# EAGLE design TRISThis (EAGLE 5.11)

## Sheet 1 of 2
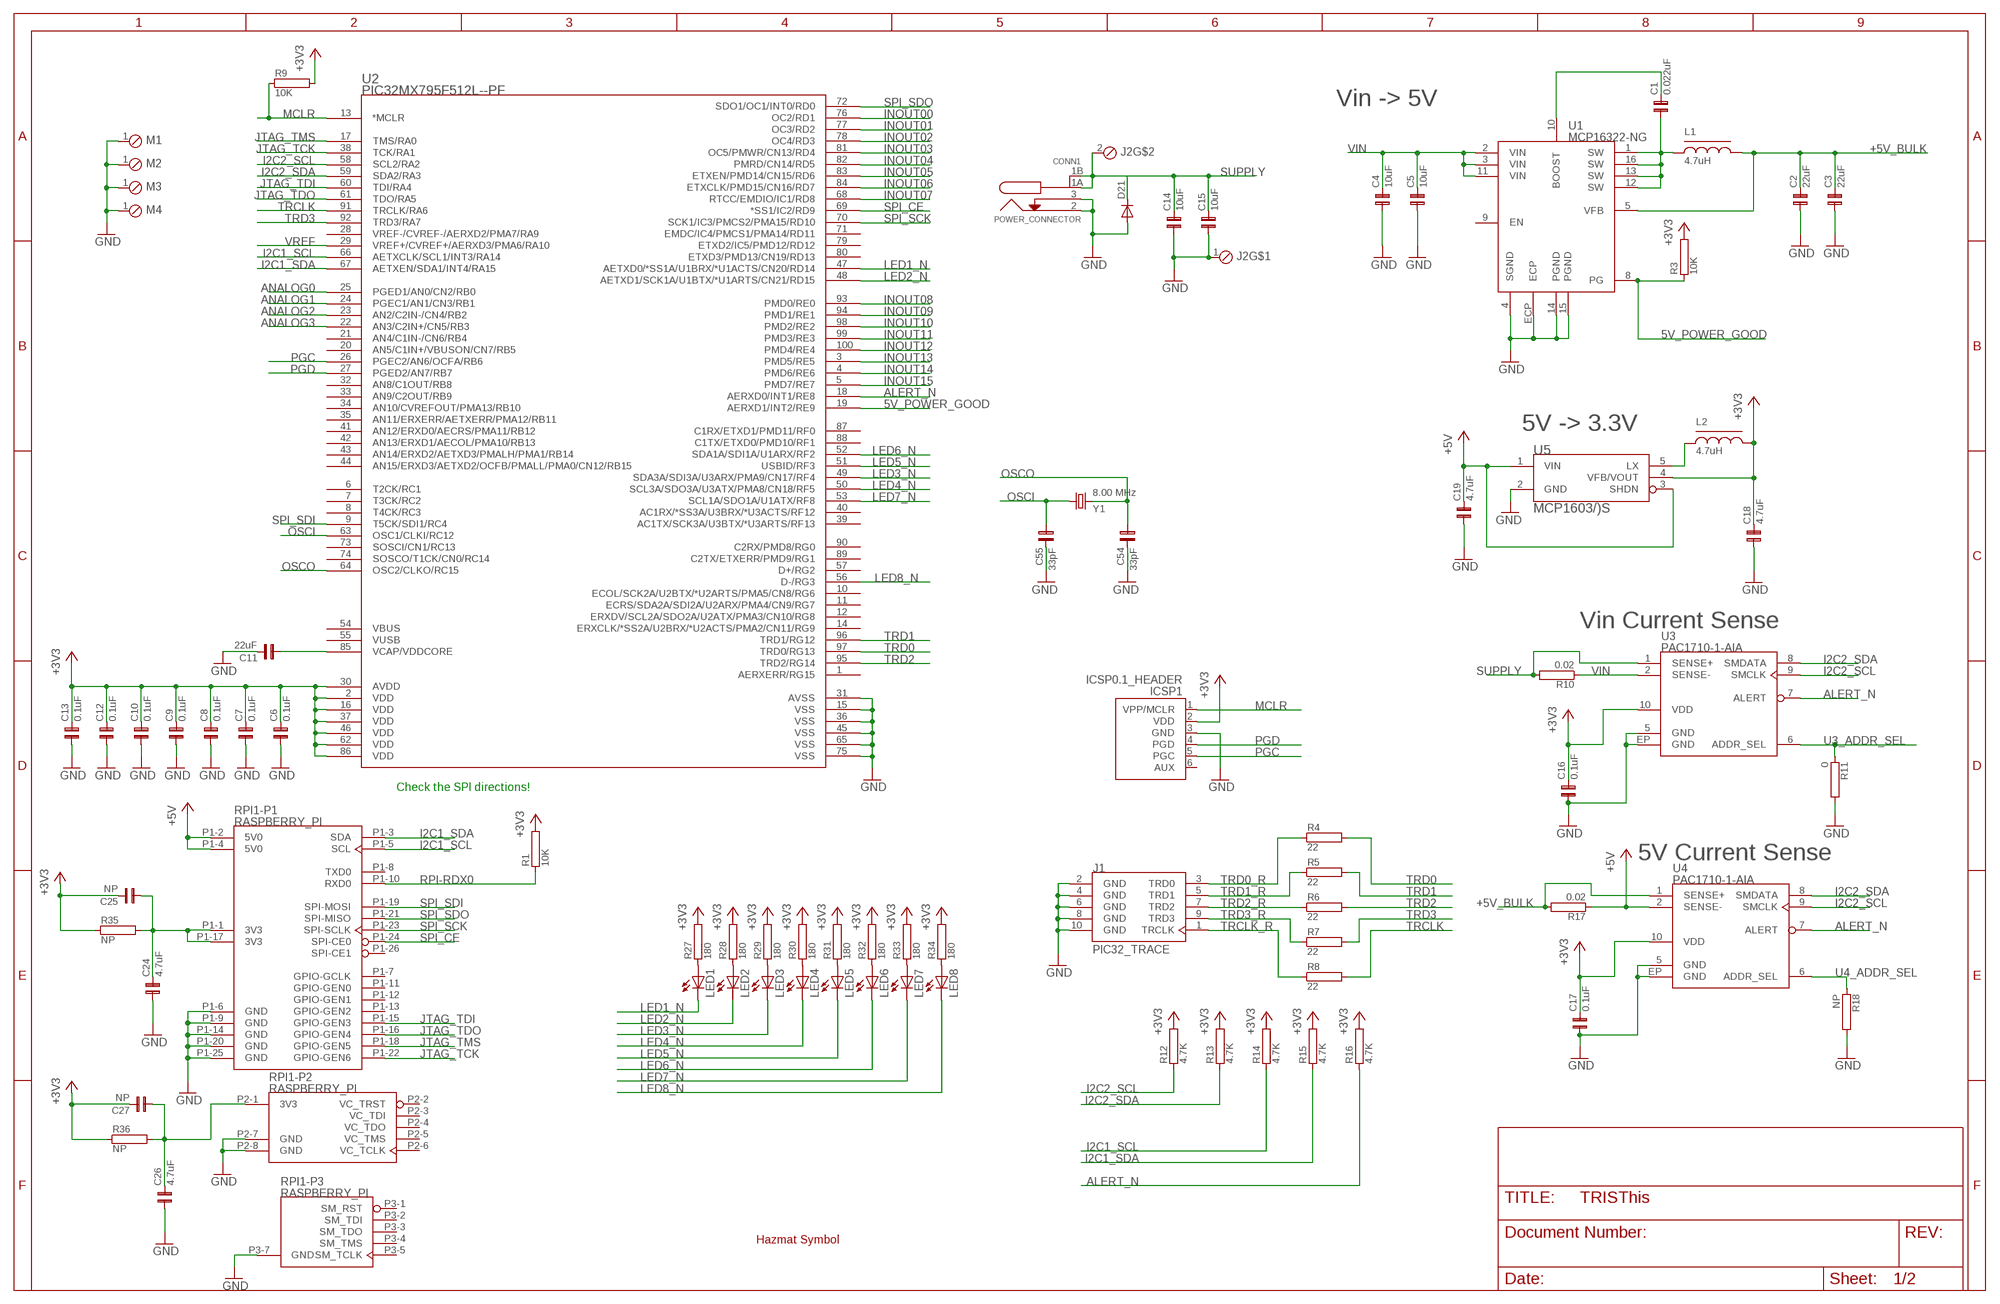
[diagram p0: schematic, sheet 1]

### Parts
C1  0.022uF  CU_SMT0603  [C0603]
C2  22uF  CU_SMT0805  [C0805]
C3  22uF  CU_SMT0805  [C0805]
C4  10uF  CU_SMT0805  [C0805]
C5  10uF  CU_SMT0805  [C0805]
C6  0.1uF  CU_SMT0603  [C0603]
C7  0.1uF  CU_SMT0603  [C0603]
C8  0.1uF  CU_SMT0603  [C0603]
C9  0.1uF  CU_SMT0603  [C0603]
C10  0.1uF  CU_SMT0603  [C0603]
C11  22uF  CU_SMT0805  [C0805]
C12  0.1uF  CU_SMT0603  [C0603]
C13  0.1uF  CU_SMT0603  [C0603]
C14  10uF  CU_SMT0805  [C0805]
C15  10uF  CU_SMT0805  [C0805]
C16  0.1uF  CU_SMT0603  [C0603]
C17  0.1uF  CU_SMT0603  [C0603]
C18  4.7uF  CU_SMT0805  [C0805]
C19  4.7uF  CU_SMT0805  [C0805]
C24  4.7uF  CU_SMT0805  [C0805]
C25  NP  CU_SMT0805  [C0805]
C26  4.7uF  CU_SMT0805  [C0805]
C27  NP  CU_SMT0805  [C0805]
C54  33pF  CU_SMT0603  [C0603]
C55  33pF  CU_SMT0603  [C0603]
CONN1  POWER_CONNECTOR  [PJ-002BH-SMT]
D21  SOD-123  [SOD-123]
ICSP1  ICSP0.1_HEADER  [ICSP]
J1  PIC32_TRACE  [2X05]
J2  2P_HEADER  [2POL254]
L1  4.7uH  L_SMTWE-PD  [WE-PD]
L2  4.7uH  L_SMTWE-PD  [WE-PD]
LED1  LEDCHIPLED_0603  [CHIPLED_0603]
LED2  LEDCHIPLED_0603  [CHIPLED_0603]
LED3  LEDCHIPLED_0603  [CHIPLED_0603]
LED4  LEDCHIPLED_0603  [CHIPLED_0603]
LED5  LEDCHIPLED_0603  [CHIPLED_0603]
LED6  LEDCHIPLED_0603  [CHIPLED_0603]
LED7  LEDCHIPLED_0603  [CHIPLED_0603]
LED8  LEDCHIPLED_0603  [CHIPLED_0603]
M1  MOUNTING  [0125_MOUNT]
M2  MOUNTING  [0125_MOUNT]
M3  MOUNTING  [0125_MOUNT]
M4  MOUNTING  [0125_MOUNT]
R1  10K  R_SMT0603  [R0603]
R3  10K  R_SMT0603  [R0603]
R4  22  R_SMT0603  [R0603]
R5  22  R_SMT0603  [R0603]
R6  22  R_SMT0603  [R0603]
R7  22  R_SMT0603  [R0603]
R8  22  R_SMT0603  [R0603]
R9  10K  R_SMT0603  [R0603]
R10  0.02  R_SMT1210  [R1210]
R11  0  R_SMT0603  [R0603]
R12  4.7K  R_SMT0603  [R0603]
R13  4.7K  R_SMT0603  [R0603]
R14  4.7K  R_SMT0603  [R0603]
R15  4.7K  R_SMT0603  [R0603]
R16  4.7K  R_SMT0603  [R0603]
R17  0.02  R_SMT1210  [R1210]
R18  NP  R_SMT0603  [R0603]
R27  180  R_SMT0603  [R0603]
R28  180  R_SMT0603  [R0603]
R29  180  R_SMT0603  [R0603]
R30  180  R_SMT0603  [R0603]
R31  180  R_SMT0603  [R0603]
R32  180  R_SMT0603  [R0603]
R33  180  R_SMT0603  [R0603]
R34  180  R_SMT0603  [R0603]
R35  NP  R_SMT0603  [R0603]
R36  NP  R_SMT0603  [R0603]
RPI1  RASPBERRY_PI  [RPI]
U1  MCP16322-NG  [NG]
U2  PIC32MX795F512L--PF  [TQFP100_14X14]
U3  PAC1710-1-AIA  [DFN10]
U4  PAC1710-1-AIA  [DFN10]
U5  MCP1603/)S  MCP1603/OS  [TSOT5_MC]
U$1  HAZMATSYMBOL  [HAZMATSYMBOL]
Y1  8.00 MHz  CS10  [CS10]

### Nets
5V_POWER_GOOD: R3.1 U1.8(PG) U2.19(AERXD1/INT2/RE9)
+3V3: C6.2 C7.2 C8.2 C9.2 C10.2 C12.2 C13.2 C16.2 C17.2 C18.2 C25.2 C27.2 ICSP1.2(VDD) L2.2 R1.2 R3.2 R9.2 R12.2 R13.2 R14.2 R15.2 R16.2 R27.2 R28.2 R29.2 R30.2 R31.2 R32.2 R33.2 R34.2 R35.1 R36.1 U2.2(VDD) U2.16(VDD) U2.30(AVDD) U2.37(VDD) U2.46(VDD) U2.62(VDD) U2.86(VDD) U3.10(VDD) U4.10(VDD) U5.4(VFB/VOUT) ; also sheet 2
+5V: C19.2 R17.1 RPI1.P1-2(-P1:5V0) RPI1.P1-4(-P1:5V0) U4.2(SENSE-) U5.1(VIN) U5.3(SHDN)
+5V_BULK: C2.2 C3.2 L1.2 R17.2 U1.5(VFB) U4.1(SENSE+)
ALERT_N: R16.1 U2.18(AERXD0/INT1/RE8) U3.7(ALERT) U4.7(ALERT)
ANALOG0: U2.25(PGED1/AN0/CN2/RB0) ; also sheet 2
ANALOG1: U2.24(PGEC1/AN1/CN3/RB1) ; also sheet 2
ANALOG2: U2.23(AN2/C2IN-/CN4/RB2) ; also sheet 2
ANALOG3: U2.22(AN3/C2IN+/CN5/RB3) ; also sheet 2
BOOST: C1.2 U1.10(BOOST)
GND: C2.1 C3.1 C4.1 C5.1 C6.1 C7.1 C8.1 C9.1 C10.1 C11.2 C12.1 C13.1 C14.1 C15.1 C16.1 C17.1 C18.1 C19.1 C24.1 C26.1 C54.2 C55.2 CONN1.2(SHIELD) CONN1.3(SHIELD_SWITCHED) D21.A ICSP1.3(GND) J1.2(GND) J1.4(GND) J1.6(GND) J1.8(GND) J1.10(GND) J2.1 M1.1 M2.1 M3.1 M4.1 R11.2 R18.2 RPI1.P1-6(-P1:GND) RPI1.P1-9(-P1:GND) RPI1.P1-14(-P1:GND) RPI1.P1-20(-P1:GND) RPI1.P1-25(-P1:GND) RPI1.P2-7(-P2:GND) RPI1.P2-8(-P2:GND) RPI1.P3-7(-P3:GND) U1.4(SGND) U1.14(PGND) U1.15(PGND) U1.ECP U2.15(VSS) U2.31(AVSS) U2.36(VSS) U2.45(VSS) U2.65(VSS) U2.75(VSS) U3.5(GND) U3.EP(GND) U4.5(GND) U4.EP(GND) U5.2(GND) ; also sheet 2
I2C1_SCL: R14.1 RPI1.P1-5(-P1:SCL) U2.66(AETXCLK/SCL1/INT3/RA14)
I2C1_SDA: R15.1 RPI1.P1-3(-P1:SDA) U2.67(AETXEN/SDA1/INT4/RA15)
I2C2_SCL: R12.1 U2.58(SCL2/RA2) U3.9(SMCLK) U4.9(SMCLK) ; also sheet 2
I2C2_SDA: R13.1 U2.59(SDA2/RA3) U3.8(SMDATA) U4.8(SMDATA) ; also sheet 2
INOUT00: U2.76(OC2/RD1) ; also sheet 2
INOUT01: U2.77(OC3/RD2) ; also sheet 2
INOUT02: U2.78(OC4/RD3) ; also sheet 2
INOUT03: U2.81(OC5/PMWR/CN13/RD4) ; also sheet 2
INOUT04: U2.82(PMRD/CN14/RD5) ; also sheet 2
INOUT05: U2.83(ETXEN/PMD14/CN15/RD6) ; also sheet 2
INOUT06: U2.84(ETXCLK/PMD15/CN16/RD7) ; also sheet 2
INOUT07: U2.68(RTCC/EMDIO/IC1/RD8) ; also sheet 2
INOUT08: U2.93(PMD0/RE0) ; also sheet 2
INOUT09: U2.94(PMD1/RE1) ; also sheet 2
INOUT10: U2.98(PMD2/RE2) ; also sheet 2
INOUT11: U2.99(PMD3/RE3) ; also sheet 2
INOUT12: U2.100(PMD4/RE4) ; also sheet 2
INOUT13: U2.3(PMD5/RE5) ; also sheet 2
INOUT14: U2.4(PMD6/RE6) ; also sheet 2
INOUT15: U2.5(PMD7/RE7) ; also sheet 2
JTAG_TCK: RPI1.P1-22(-P1:GPIO-GEN6) U2.38(TCK/RA1)
JTAG_TDI: RPI1.P1-15(-P1:GPIO-GEN3) U2.60(TDI/RA4)
JTAG_TDO: RPI1.P1-16(-P1:GPIO-GEN4) U2.61(TDO/RA5)
JTAG_TMS: RPI1.P1-18(-P1:GPIO-GEN5) U2.17(TMS/RA0)
LED1_N: LED1.C U2.47(AETXD0/*SS1A/U1BRX/*U1ACTS/CN20/RD14)
LED2_N: LED2.C U2.48(AETXD1/SCK1A/U1BTX/*U1ARTS/CN21/RD15)
LED3_N: LED3.C U2.49(SDA3A/SDI3A/U3ARX/PMA9/CN17/RF4)
LED4_N: LED4.C U2.50(SCL3A/SDO3A/U3ATX/PMA8/CN18/RF5)
LED5_N: LED5.C U2.51(USBID/RF3)
LED6_N: LED6.C U2.52(SDA1A/SDI1A/U1ARX/RF2)
LED7_N: LED7.C U2.53(SCL1A/SDO1A/U1ATX/RF8)
LED8_N: LED8.C U2.56(D-/RG3)
MCLR: ICSP1.1(VPP/MCLR) R9.1 U2.13(*MCLR)
N$2: L2.1 U5.5(LX)
N$5: LED1.A R27.1
N$11: LED2.A R28.1
N$13: LED3.A R29.1
N$14: LED4.A R30.1
N$15: LED5.A R31.1
N$16: LED6.A R32.1
N$17: LED7.A R33.1
N$18: LED8.A R34.1
OSCI: C55.1 U2.63(OSC1/CLKI/RC12) Y1.P$1
OSCO: C54.1 U2.64(OSC2/CLKO/RC15) Y1.P$2
PGC: ICSP1.5(PGC) U2.26(PGEC2/AN6/OCFA/RB6)
PGD: ICSP1.4(PGD) U2.27(PGED2/AN7/RB7)
RPI+3V1: C26.2 C27.1 R36.2 RPI1.P2-1(-P2:3V3)
RPI+3V3: C24.2 C25.1 R35.2 RPI1.P1-1(-P1:3V3) RPI1.P1-17(-P1:3V3)
RPI-RDX0: R1.1 RPI1.P1-10(-P1:RXD0)
SPI_CE: RPI1.P1-24(-P1:SPI-CE0) U2.69(*SS1/IC2/RD9)
SPI_SCK: RPI1.P1-23(-P1:SPI-SCLK) U2.70(SCK1/IC3/PMCS2/PMA15/RD10)
SPI_SDI: RPI1.P1-19(-P1:SPI-MOSI) U2.9(T5CK/SDI1/RC4)
SPI_SDO: RPI1.P1-21(-P1:SPI-MISO) U2.72(SDO1/OC1/INT0/RD0)
SUPPLY: C14.2 C15.2 CONN1.1A(CENTER-1) CONN1.1B(CENTER-2) D21.K J2.2 R10.2 U3.1(SENSE+)
SW: C1.1 L1.1 U1.1(SW) U1.12(SW) U1.13(SW) U1.16(SW)
TRCLK: R8.2 U2.91(TRCLK/RA6)
TRCLK_R: J1.1(TRCLK) R8.1
TRD0: R4.2 U2.97(TRD0/RG13)
TRD0_R: J1.3(TRD0) R4.1
TRD1: R5.2 U2.96(TRD1/RG12)
TRD1_R: J1.5(TRD1) R5.1
TRD2: R6.2 U2.95(TRD2/RG14)
TRD2_R: J1.7(TRD2) R6.1
TRD3: R7.2 U2.92(TRD3/RA7)
TRD3_R: J1.9(TRD3) R7.1
U3_ADDR_SEL: R11.1 U3.6(ADDR_SEL)
U4_ADDR_SEL: R18.1 U4.6(ADDR_SEL)
VDDCORE: C11.1 U2.85(VCAP/VDDCORE)
VIN: C4.2 C5.2 R10.1 U1.2(VIN) U1.3(VIN) U1.11(VIN) U3.2(SENSE-)
VREF: U2.29(VREF+/CVREF+/AERXD3/PMA6/RA10) ; also sheet 2
Unconnected: ICSP1.6(AUX) RPI1.P1-7(-P1:GPIO-GCLK) RPI1.P1-8(-P1:TXD0) RPI1.P1-11(-P1:GPIO-GEN0) RPI1.P1-12(-P1:GPIO-GEN1) RPI1.P1-13(-P1:GPIO-GEN2) RPI1.P1-26(-P1:SPI-CE1) RPI1.P2-2(-P2:VC_TRST) RPI1.P2-3(-P2:VC_TDI) RPI1.P2-4(-P2:VC_TDO) RPI1.P2-5(-P2:VC_TMS) RPI1.P2-6(-P2:VC_TCLK) RPI1.P3-1(-P3:SM_RST) RPI1.P3-2(-P3:SM_TDI) RPI1.P3-3(-P3:SM_TDO) RPI1.P3-4(-P3:SM_TMS) RPI1.P3-5(-P3:SM_TCLK) U1.9(EN) U2.1(AERXERR/RG15) U2.6(T2CK/RC1) U2.7(T3CK/RC2) U2.8(T4CK/RC3) U2.10(ECOL/SCK2A/U2BTX/*U2ARTS/PMA5/CN8/RG6) U2.11(ECRS/SDA2A/SDI2A/U2ARX/PMA4/CN9/RG7) U2.12(ERXDV/SCL2A/SDO2A/U2ATX/PMA3/CN10/RG8) U2.14(ERXCLK/*SS2A/U2BRX/*U2ACTS/PMA2/CN11/RG9) U2.20(AN5/C1IN+/VBUSON/CN7/RB5) U2.21(AN4/C1IN-/CN6/RB4) U2.28(VREF-/CVREF-/AERXD2/PMA7/RA9) U2.32(AN8/C1OUT/RB8) U2.33(AN9/C2OUT/RB9) U2.34(AN10/CVREFOUT/PMA13/RB10) U2.35(AN11/ERXERR/AETXERR/PMA12/RB11) U2.39(AC1TX/SCK3A/U3BTX/*U3ARTS/RF13) U2.40(AC1RX/*SS3A/U3BRX/*U3ACTS/RF12) U2.41(AN12/ERXD0/AECRS/PMA11/RB12) U2.42(AN13/ERXD1/AECOL/PMA10/RB13) U2.43(AN14/ERXD2/AETXD3/PMALH/PMA1/RB14) U2.44(AN15/ERXD3/AETXD2/OCFB/PMALL/PMA0/CN12/RB15) U2.54(VBUS) U2.55(VUSB) U2.57(D+/RG2) U2.71(EMDC/IC4/PMCS1/PMA14/RD11) U2.73(SOSCI/CN1/RC13) U2.74(SOSCO/T1CK/CN0/RC14) U2.79(ETXD2/IC5/PMD12/RD12) U2.80(ETXD3/PMD13/CN19/RD13) U2.87(C1RX/ETXD1/PMD11/RF0) U2.88(C1TX/ETXD0/PMD10/RF1) U2.89(C2TX/ETXERR/PMD9/RG1) U2.90(C2RX/PMD8/RG0)

### Notes on the sheet
- Vin -> 5V
- 5V -> 3.3V
- Vin Current Sense
- Check the SPI directions!
- 5V Current Sense

## Sheet 2 of 2
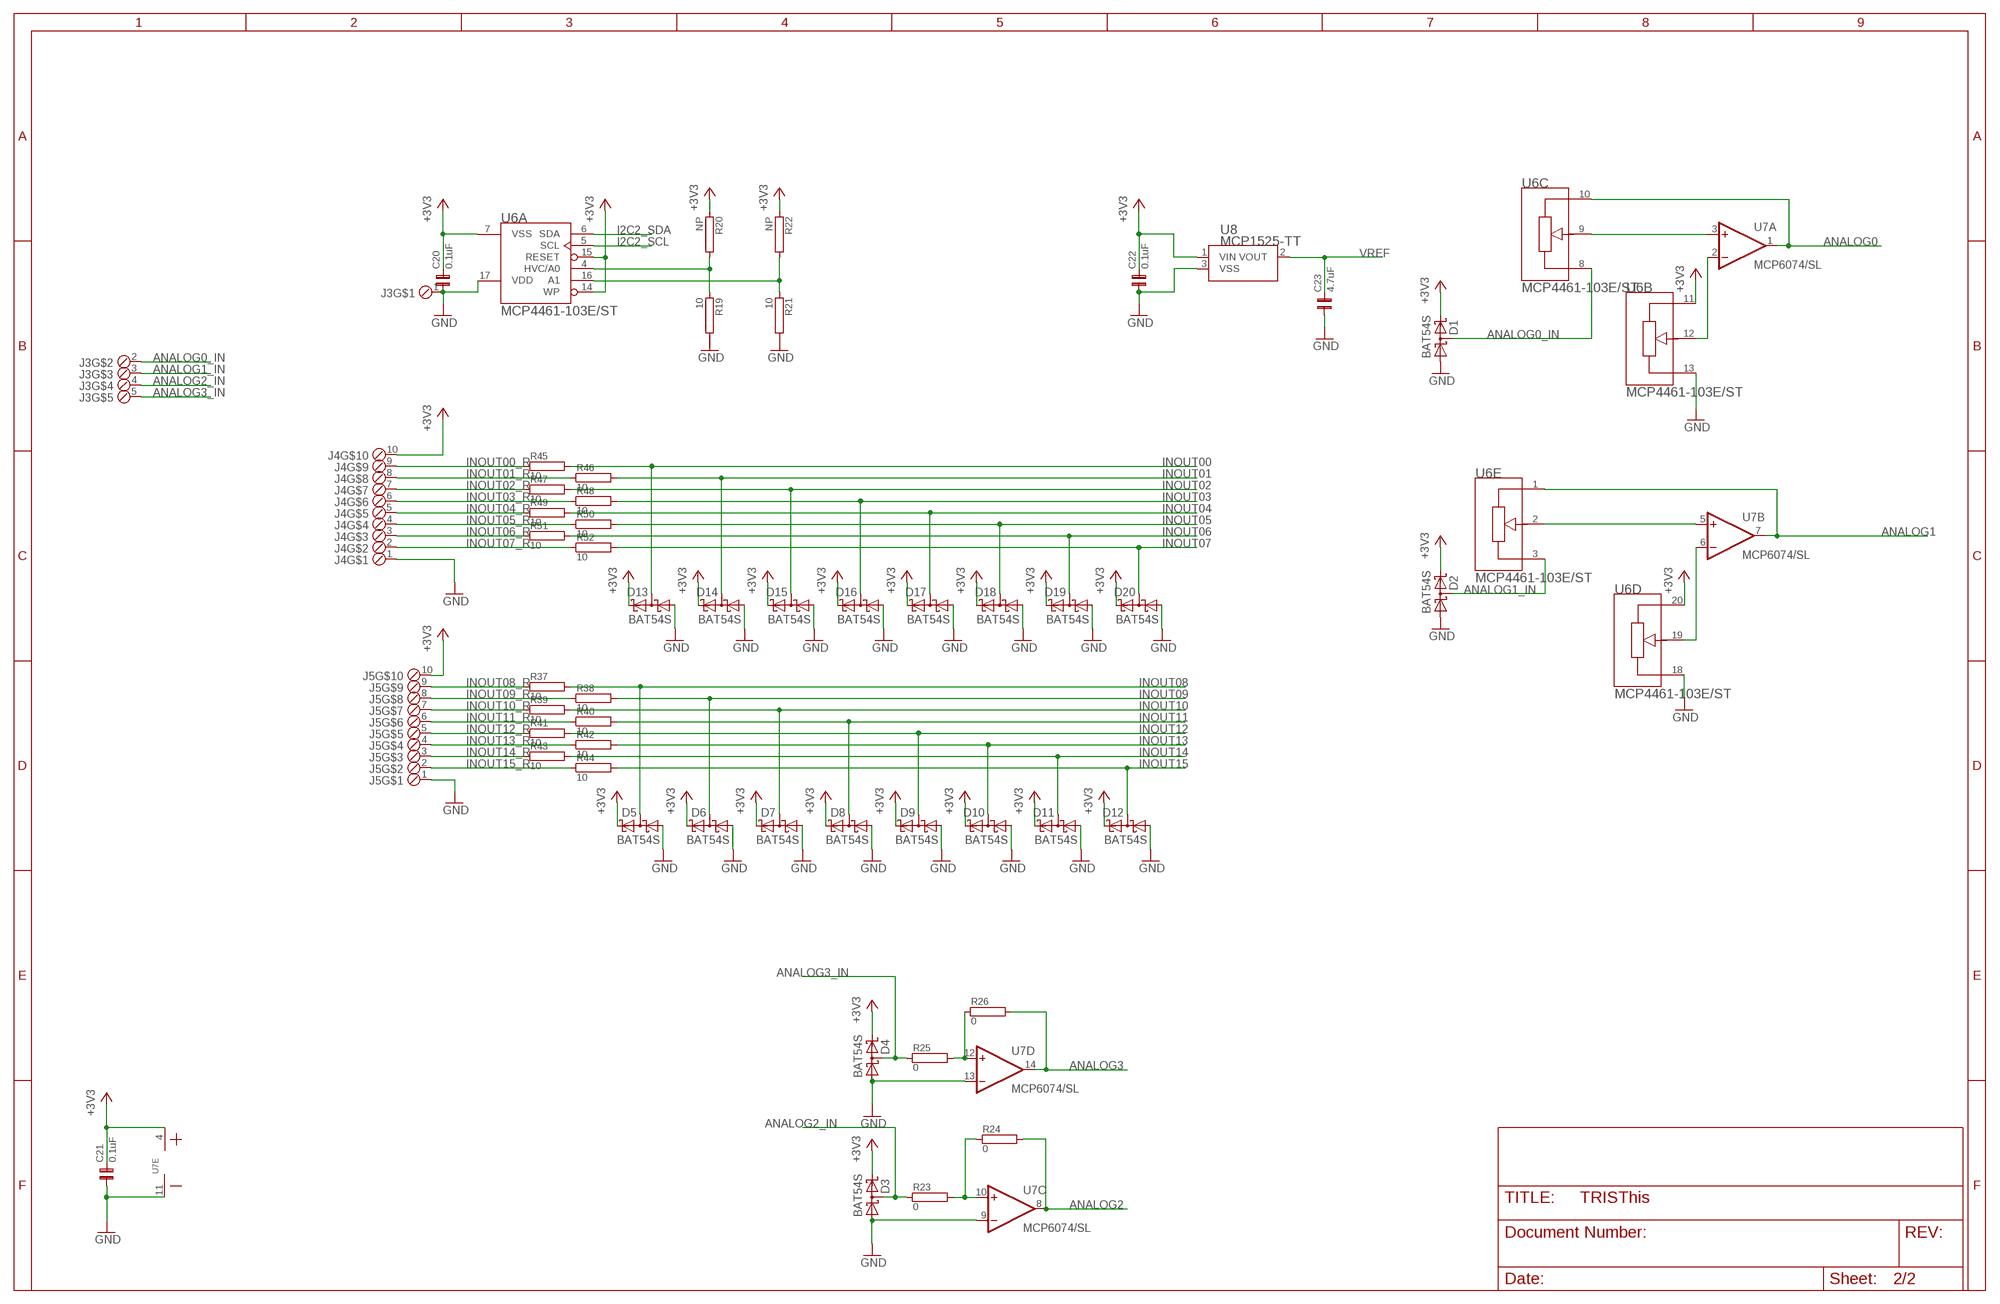
[diagram p1: schematic, sheet 2]

### Parts
C20  0.1uF  CU_SMT0603  [C0603]
C21  0.1uF  CU_SMT0603  [C0603]
C22  0.1uF  CU_SMT0603  [C0603]
C23  4.7uF  CU_SMT0603  [C0603]
D1  BAT54S  [SOT23]
D2  BAT54S  [SOT23]
D3  BAT54S  [SOT23]
D4  BAT54S  [SOT23]
D5  BAT54S  [SOT23]
D6  BAT54S  [SOT23]
D7  BAT54S  [SOT23]
D8  BAT54S  [SOT23]
D9  BAT54S  [SOT23]
D10  BAT54S  [SOT23]
D11  BAT54S  [SOT23]
D12  BAT54S  [SOT23]
D13  BAT54S  [SOT23]
D14  BAT54S  [SOT23]
D15  BAT54S  [SOT23]
D16  BAT54S  [SOT23]
D17  BAT54S  [SOT23]
D18  BAT54S  [SOT23]
D19  BAT54S  [SOT23]
D20  BAT54S  [SOT23]
J3  5P_HEADER  [5POL254]
J4  10P_HEADER  [10POL254]
J5  10P_HEADER  [10POL254]
R19  10  R_SMT0603  [R0603]
R20  NP  R_SMT0603  [R0603]
R21  10  R_SMT0603  [R0603]
R22  NP  R_SMT0603  [R0603]
R23  0  R_SMT0603  [R0603]
R24  0  R_SMT0603  [R0603]
R25  0  R_SMT0603  [R0603]
R26  0  R_SMT0603  [R0603]
R37  10  R_SMT0603  [R0603]
R38  10  R_SMT0603  [R0603]
R39  10  R_SMT0603  [R0603]
R40  10  R_SMT0603  [R0603]
R41  10  R_SMT0603  [R0603]
R42  10  R_SMT0603  [R0603]
R43  10  R_SMT0603  [R0603]
R44  10  R_SMT0603  [R0603]
R45  10  R_SMT0603  [R0603]
R46  10  R_SMT0603  [R0603]
R47  10  R_SMT0603  [R0603]
R48  10  R_SMT0603  [R0603]
R49  10  R_SMT0603  [R0603]
R50  10  R_SMT0603  [R0603]
R51  10  R_SMT0603  [R0603]
R52  10  R_SMT0603  [R0603]
U6  MCP4461-103E/ST  MCP4461/ST  [TSSOP20_MC]
U7  MCP6074/SL  [SOIC14-N_MC]
U8  MCP1525-TT  [SOT-23_MC]

### Nets
+3V3: C20.2 C21.2 C22.2 D1.2(C2) D2.2(C2) D3.2(C2) D4.2(C2) D5.2(C2) D6.2(C2) D7.2(C2) D8.2(C2) D9.2(C2) D10.2(C2) D11.2(C2) D12.2(C2) D13.2(C2) D14.2(C2) D15.2(C2) D16.2(C2) D17.2(C2) D18.2(C2) D19.2(C2) D20.2(C2) J4.10 J5.10 R20.1 R22.1 U6.7(A:VSS) U6.11(B:A) U6.14(A:WP) U6.15(A:RESET) U6.20(D:A) U7.4(E:V+) U8.1(VIN) ; also sheet 1
ADDR_SEL2: R19.1 R20.2 U6.4(A:HVC/A0)
ADDR_SEL3: R21.1 R22.2 U6.16(A:A1)
ANALOG0: U6.10(C:A) U7.1(A:OUT) ; also sheet 1
ANALOG0_IN: D1.3(C1A2) J3.2 U6.8(C:B)
ANALOG1: U6.1(E:A) U7.7(B:OUT) ; also sheet 1
ANALOG1_IN: D2.3(C1A2) J3.3 U6.3(E:B)
ANALOG2: R24.2 U7.8(C:OUT) ; also sheet 1
ANALOG2_IN: D3.3(C1A2) J3.4 R23.1
ANALOG3: R26.2 U7.14(D:OUT) ; also sheet 1
ANALOG3_IN: D4.3(C1A2) J3.5 R25.1
GND: C20.1 C21.1 C22.1 C23.1 D1.1(A1) D2.1(A1) D3.1(A1) D4.1(A1) D5.1(A1) D6.1(A1) D7.1(A1) D8.1(A1) D9.1(A1) D10.1(A1) D11.1(A1) D12.1(A1) D13.1(A1) D14.1(A1) D15.1(A1) D16.1(A1) D17.1(A1) D18.1(A1) D19.1(A1) D20.1(A1) J3.1 J4.1 J5.1 R19.2 R21.2 U6.13(B:B) U6.17(A:VDD) U6.18(D:B) U7.9(C:-IN) U7.11(E:V-) U7.13(D:-IN) U8.3(VSS) ; also sheet 1
I2C2_SCL: U6.5(A:SCL) ; also sheet 1
I2C2_SDA: U6.6(A:SDA) ; also sheet 1
INOUT00: D13.3(C1A2) R45.2 ; also sheet 1
INOUT00_R: J4.9 R45.1
INOUT01: D14.3(C1A2) R46.2 ; also sheet 1
INOUT01_R: J4.8 R46.1
INOUT02: D15.3(C1A2) R47.2 ; also sheet 1
INOUT02_R: J4.7 R47.1
INOUT03: D16.3(C1A2) R48.2 ; also sheet 1
INOUT03_R: J4.6 R48.1
INOUT04: D17.3(C1A2) R49.2 ; also sheet 1
INOUT04_R: J4.5 R49.1
INOUT05: D18.3(C1A2) R50.2 ; also sheet 1
INOUT05_R: J4.4 R50.1
INOUT06: D19.3(C1A2) R51.2 ; also sheet 1
INOUT06_R: J4.3 R51.1
INOUT07: D20.3(C1A2) R52.2 ; also sheet 1
INOUT07_R: J4.2 R52.1
INOUT08: D5.3(C1A2) R37.2 ; also sheet 1
INOUT08_R: J5.9 R37.1
INOUT09: D6.3(C1A2) R38.2 ; also sheet 1
INOUT09_R: J5.8 R38.1
INOUT10: D7.3(C1A2) R39.2 ; also sheet 1
INOUT10_R: J5.7 R39.1
INOUT11: D8.3(C1A2) R40.2 ; also sheet 1
INOUT11_R: J5.6 R40.1
INOUT12: D9.3(C1A2) R41.2 ; also sheet 1
INOUT12_R: J5.5 R41.1
INOUT13: D10.3(C1A2) R42.2 ; also sheet 1
INOUT13_R: J5.4 R42.1
INOUT14: D11.3(C1A2) R43.2 ; also sheet 1
INOUT14_R: J5.3 R43.1
INOUT15: D12.3(C1A2) R44.2 ; also sheet 1
INOUT15_R: J5.2 R44.1
N$4: U6.12(B:W) U7.2(A:-IN)
N$6: U6.9(C:W) U7.3(A:+IN)
N$7: U6.19(D:W) U7.6(B:-IN)
N$8: U6.2(E:W) U7.5(B:+IN)
N$9: R23.2 R24.1 U7.10(C:+IN)
N$12: R25.2 R26.1 U7.12(D:+IN)
VREF: C23.2 U8.2(VOUT) ; also sheet 1

## Library data of the parts
C1-C5 C11 C14 C15 C18 C19 C24-C27 = V3:CU_SMT: Unpolarized surface mount capacitors
C6-C10 C12 C13 C16 C17 C20-C23 = TRISThis:CU_SMT: Unpolarized surface mount capacitors
C54 C55 = PLM_Demo:CU_SMT: Unpolarized surface mount capacitors
CONN1 = untitled:POWER_CONNECTOR
D1-D20 = PLM_Demo:BAT54S
D21 = TridentSMD:SOD-123
ICSP1 = TRISThis:ICSP: Microchip ICSP connector
J1 = TRISThis:PIC32_TRACE
J2 = TRISThisConnectors:2P_HEADER: Buchanan 282834-2
J3 = TRISThisConnectors:5P_HEADER: Buchanan 282834-5
J4 J5 = TRISThisConnectors:10P_HEADER: Buchanan 282834-10
L1 L2 = MCP1632x:L_SMT
LED1-LED8 = PLM_Demo:LED: LED OSRAM: - CHIPLED LG R971, LG N971, LY N971, LG Q971, LY Q971, LO R971, LY R971 LH N974, LH R974 LS Q976, LO Q976, LY Q976 LO Q996 - Hyper CHIPLED LW Q18S LB Q993, LB Q99A, LB R99A - SideLED LS A670, LO A670, LY A670, LG A670, LP A670 LB A673, LV A673, LT A673, LW A673 LH A674 LY A675 LS A676, LA A676, LO A676, LY A676, LW A676 LS A679, LY A679, LG A679 - Hyper Micro SIDELED® LS Y876, LA Y876, LO Y876, LY Y876 LT Y87S - SmartLED LW L88C, LW L88S LB L89C, LB L89S, LG L890 LS L89K, LO L89K, LY L89K LS L896, LA L896, LO L896, LY L896 - TOPLED LS T670, LO T670, LY T670, LG T670, LP T670 LSG T670, LSP T670, LSY T670, LOP T670, LYG T670 LG T671, LOG T671, LSG T671 LB T673, LV T673, LT T673, LW T673 LH T674 LS T676, LA T676, LO T676, LY T676, LB T676, LH T676, LSB T676, LW T676 LB T67C, LV T67C, LT T67C, LS T67K, LO T67K, LY T67K, LW E67C LS E67B, LA E67B, LO E67B, LY E67B, LB E67C, LV E67C, LT E67C LW T67C LS T679, LY T679, LG T679 LS T770, LO T770, LY T770, LG T770, LP T770 LB T773, LV T773, LT T773, LW T773 LH T774 LS E675, LA E675, LY E675, LS T675 LS T776, LA T776, LO T776, LY T776, LB T776 LHGB T686 LT T68C, LB T68C - Hyper Mini TOPLED® LB M676 - Mini TOPLED Santana® LG M470 LS M47K, LO M47K, LY M47K Source: http://www.osram.convergy.de - LUMILED® LXK2-PW12-R00, LXK2-PW12-S00, LXK2-PW14-U00, LXK2-PW14-V00 LXK2-PM12-R00, LXK2-PM12-S00, LXK2-PM14-U00 LXK2-PE12-Q00, LXK2-PE12-R00, LXK2-PE12-S00, LXK2-PE14-T00, LXK2-PE14-U00 LXK2-PB12-K00, LXK2-PB12-L00, LXK2-PB12-M00, LXK2-PB14-N00, LXK2-PB14-P00, LXK2-PB14-Q00 LXK2-PR12-L00, LXK2-PR12-M00, LXK2-PR14-Q00, LXK2-PR14-R00 LXK2-PD12-Q00, LXK2-PD12-R00, LXK2-PD12-S00 LXK2-PH12-R00, LXK2-PH12-S00 LXK2-PL12-P00, LXK2-PL12-Q00, LXK2-PL12-R00 Source: www.luxeon.com
M1-M4 = TRISThisConnectors:MOUNTING
R1 R4-R52 = TRISThis:R_SMT
R3 = V3:R_SMT
RPI1 = RaspberryPi:RASPBERRY_PI
U1 = MCP1632x:MCP16322
U2 = TRISThis:PIC32MX795F512L-
U3 U4 = PAC1710:PAC1710-1
U5 = MCP1603:MCP1603
U6 = MCP4461:MCP4461
U7 = MCP6074:MCP6074
U8 = batterymon:MCP1525
U$1 = mjb-custom:HAZMATSYMBOL
Y1 = PLM_Demo:CS10

## Board
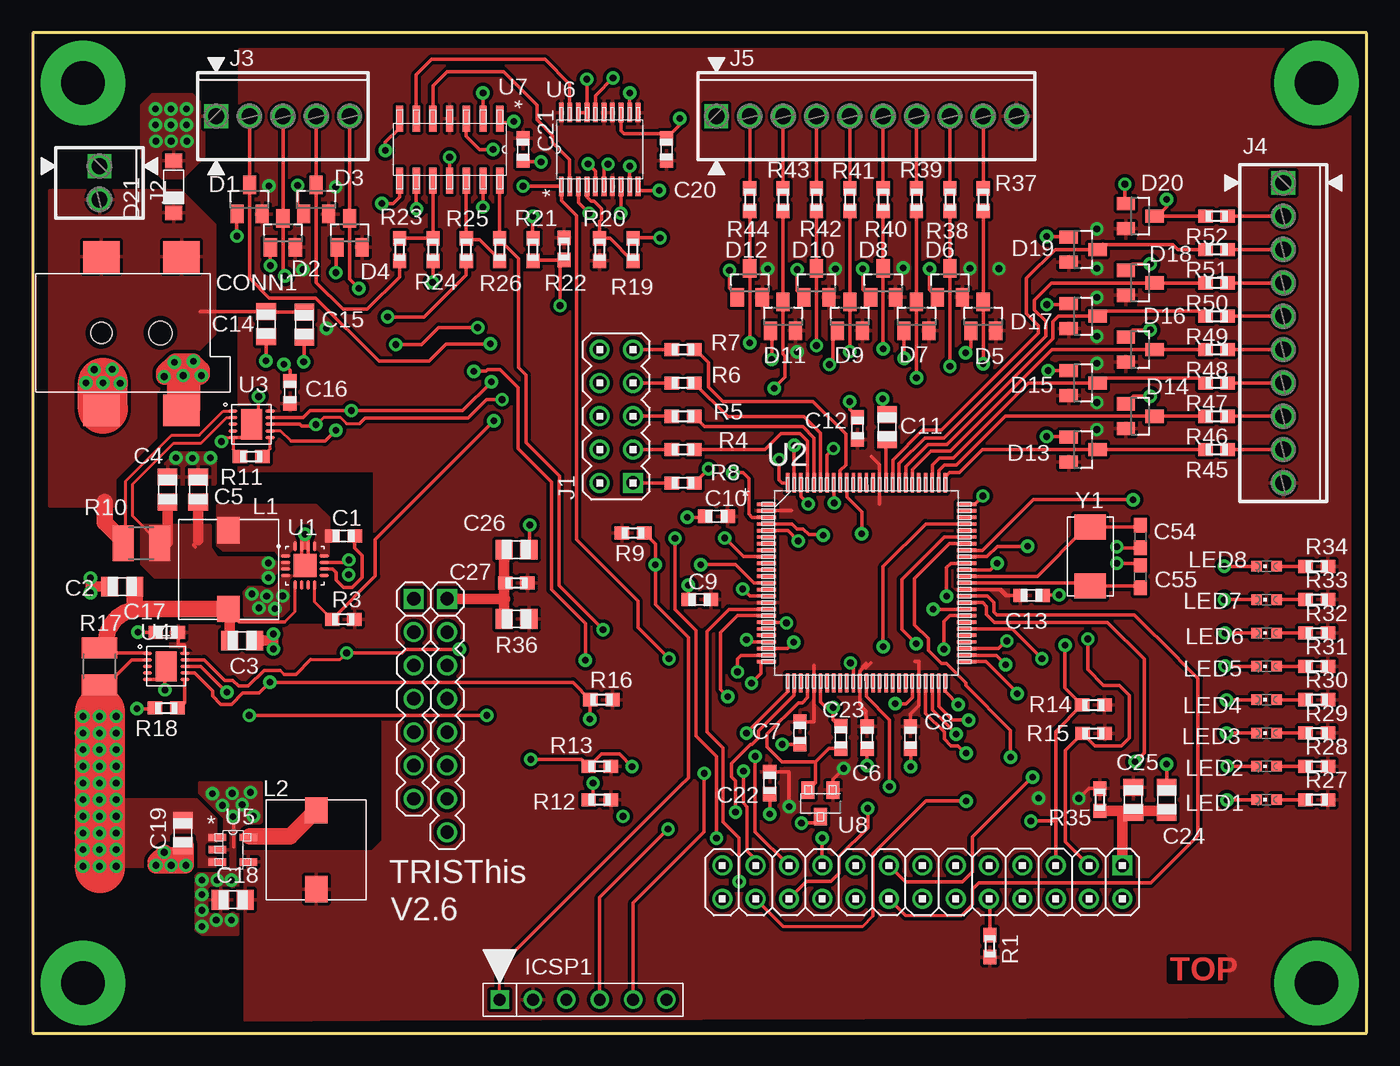
[diagram p2: board, top side]
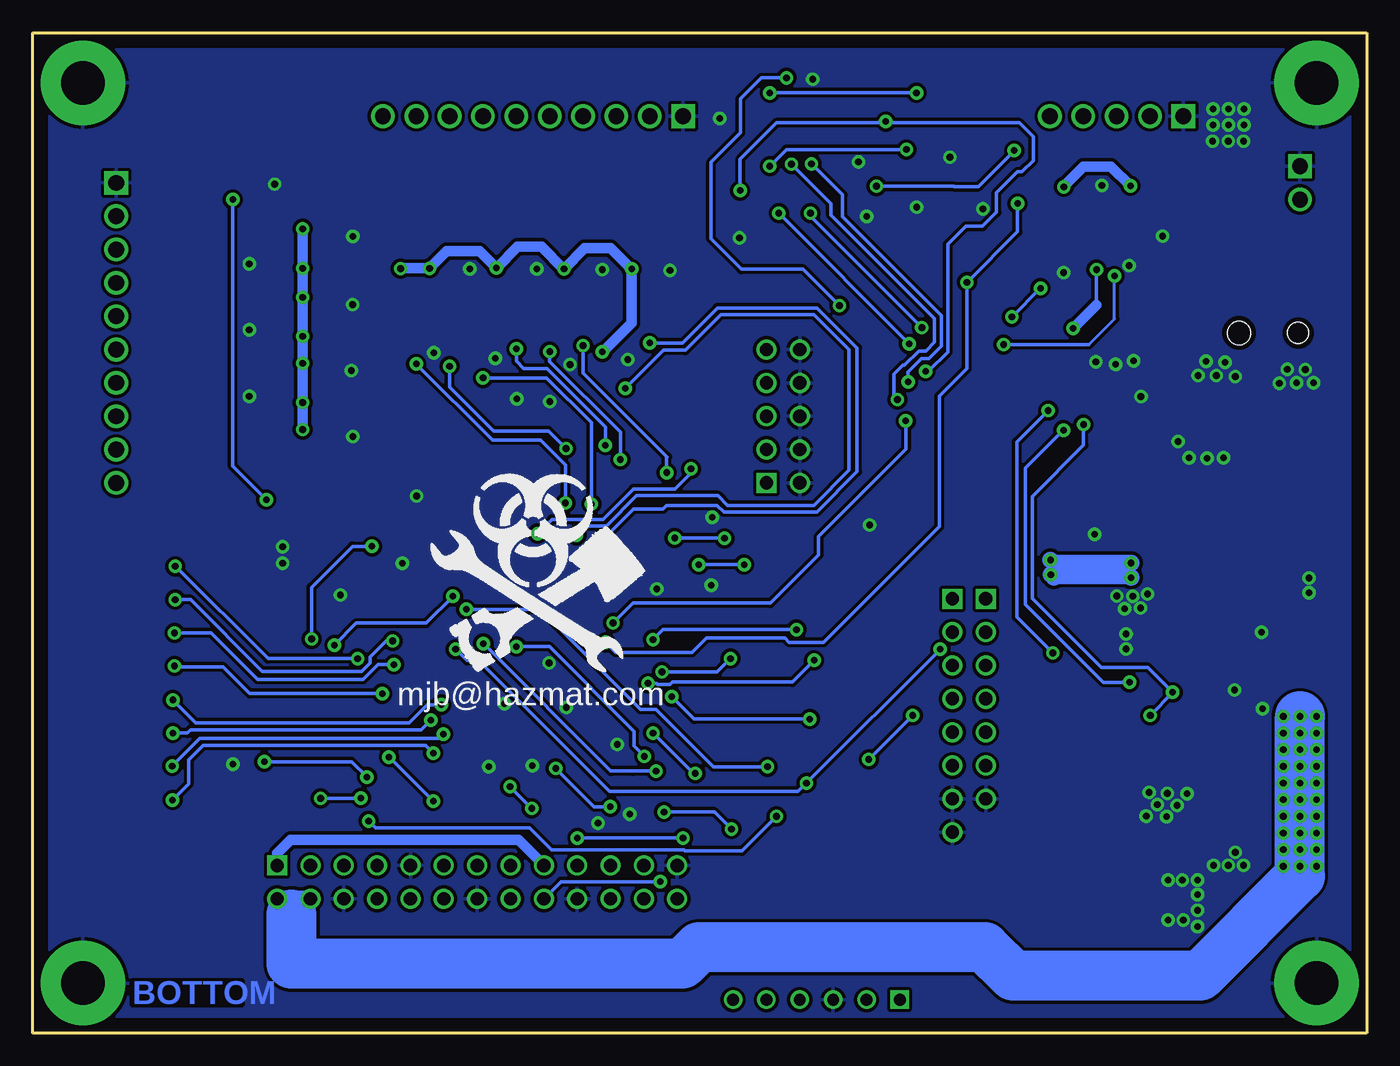
[diagram p3: board, bottom side, seen from below]

Size 101.6 x 76.2 mm. Coordinates in mm from the lower left corner, seen from the top.
Outline: 0,0 101.6,0 101.6,76.2 0,76.2 0,0
Copper layers (1*16): Top 0.035mm / dielectric 1mm / Bottom 0.035mm
Design rules "default *": minimum track width 9.5mil, minimum drill 20mil, track to track 10mil, track to pad 10mil, pad to pad 10mil, via to via 10mil, smd to smd 0mil, copper to edge 15mil, drill to drill 20mil, minimum pad ring 10mil, minimum via ring 10mil, stop-mask expansion 0mil, vias tented up to drill 21mil, thermal gap 10mil

### Footprints (pad centres in the part's own frame; a part is rotated, then mirrored left to right if it is on the bottom)
C0603 = smd 1.1 x 1: 1 -0.85,0; 2 0.85,0
C0805 = smd 1.3 x 1.5: 1 -0.95,0; 2 0.95,0
PJ-002BH-SMT = smd 2.8 x 2.4: 1A -2.4,5.8; 1B 3.7,5.8; 2 -2.4,-5.9; 3 3.7,-5.9 | hole 1.6: -2.4,0 | hole 1.8: 2.1,0
SOT23 = smd 1 x 1.4: 1 -0.95,-1.1; 2 0.95,-1.1; 3 0,1.1
SOD-123 = smd 1.092 x 1.295: A 1.981,-0.051; K -1.981,-0.051
ICSP = drill 0.9 square: 1 -6.35,0 | drill 0.9 round: 2 -3.81,0; 3 -1.27,0; 4 1.27,0; 5 3.81,0; 6 6.35,0
2X05 = drill 1.016 square: 1 -5.08,-1.27 | drill 1.016 round: 2 -5.08,1.27; 3 -2.54,-1.27; 4 -2.54,1.27; 5 0,-1.27; 6 0,1.27; 7 2.54,-1.27; 8 2.54,1.27; 9 5.08,-1.27; 10 5.08,1.27
2POL254 = drill 1.2 square: 1 -1.27,0 | drill 1.2 round: 2 1.27,0
5POL254 = drill 1.2 square: 1 -5.08,0 | drill 1.2 round: 2 -2.54,0; 3 0,0; 4 2.54,0; 5 5.08,0
10POL254 = drill 1.2 square: 1 -11.43,0 | drill 1.2 round: 2 -8.89,0; 3 -6.35,0; 4 -3.81,0; 5 -1.27,0; 6 1.27,0; 7 3.81,0; 8 6.35,0; 9 8.89,0; 10 11.43,0
WE-PD = smd 1.7 x 2: 1 0,3; 2 0,-3
CHIPLED_0603 = smd 0.8 x 0.8: A 0,-0.75; C 0,0.75
0125_MOUNT = drill 3.302 pad 6.452 round: 1 0,0
R0603 = smd 1.1 x 1: 1 -0.85,0; 2 0.85,0
R1210 = smd 1.6 x 2.7: 1 -1.4,0; 2 1.4,0
RPI = drill 1.016 square: P1-1 -5.144,-2.095; P2-1 -25.463,-53.531; P3-1 -25.463,-56.071 | drill 1.016 round: P1-2 -2.603,-2.095; P1-3 -5.144,-4.636; P1-4 -2.603,-4.636; P1-5 -5.144,-7.176; P1-6 -2.603,-7.176; P1-7 -5.144,-9.716; P1-8 -2.603,-9.716; P1-9 -5.144,-12.255; P1-10 -2.603,-12.255; P1-11 -5.144,-14.796; P1-12 -2.603,-14.796; P1-13 -5.144,-17.335; P1-14 -2.603,-17.335; P1-15 -5.144,-19.875; P1-16 -2.603,-19.875; P1-17 -5.144,-22.416; P1-18 -2.603,-22.416; P1-19 -5.144,-24.956; P1-20 -2.603,-24.956; P1-21 -5.144,-27.495; P1-22 -2.603,-27.495; P1-23 -5.144,-30.035; P1-24 -2.603,-30.035; P1-25 -5.144,-32.575; P1-26 -2.603,-32.575; P2-2 -22.924,-53.531; P2-3 -20.384,-53.531; P2-4 -17.843,-53.531; P2-5 -15.303,-53.531; P2-6 -12.764,-53.531; P2-7 -10.223,-53.531; P2-8 -7.684,-53.531; P3-2 -22.924,-56.071; P3-3 -20.384,-56.071; P3-4 -17.843,-56.071; P3-5 -15.303,-56.071; P3-6 -12.764,-56.071; P3-7 -10.223,-56.071
NG = smd 0.737 x 0.267: 1 -1.475,0.75; 2 -1.475,0.25; 3 -1.475,-0.25; 4 -1.475,-0.75; 9 1.475,-0.75; 10 1.475,-0.25; 11 1.475,0.25; 12 1.475,0.75 | smd 0.267 x 0.737: 5 -0.75,-1.475; 6 -0.25,-1.475; 7 0.25,-1.475; 8 0.75,-1.475; 13 0.75,1.475; 14 0.25,1.475; 15 -0.25,1.475; 16 -0.75,1.475 | smd 1.753 x 1.753: ECP 0,0
TQFP100_14X14 = smd 1.473 x 0.254: 1 -7.62,5.994; 2 -7.62,5.512; 3 -7.62,5.004; 4 -7.62,4.496; 5 -7.62,3.988; 6 -7.62,3.505; 7 -7.62,2.997; 8 -7.62,2.489; 9 -7.62,2.007; 10 -7.62,1.499; 11 -7.62,0.991; 12 -7.62,0.508; 13 -7.62,0; 14 -7.62,-0.508; 15 -7.62,-0.991; 16 -7.62,-1.499; 17 -7.62,-2.007; 18 -7.62,-2.489; 19 -7.62,-2.997; 20 -7.62,-3.505; 21 -7.62,-3.988; 22 -7.62,-4.496; 23 -7.62,-5.004; 24 -7.62,-5.512; 25 -7.62,-5.994; 51 7.62,-5.994; 52 7.62,-5.512; 53 7.62,-5.004; 54 7.62,-4.496; 55 7.62,-3.988; 56 7.62,-3.505; 57 7.62,-2.997; 58 7.62,-2.489; 59 7.62,-2.007; 60 7.62,-1.499; 61 7.62,-0.991; 62 7.62,-0.508; 63 7.62,0; 64 7.62,0.508; 65 7.62,0.991; 66 7.62,1.499; 67 7.62,2.007; 68 7.62,2.489; 69 7.62,2.997; 70 7.62,3.505; 71 7.62,3.988; 72 7.62,4.496; 73 7.62,5.004; 74 7.62,5.512; 75 7.62,5.994 | smd 0.254 x 1.473: 26 -5.994,-7.62; 27 -5.512,-7.62; 28 -5.004,-7.62; 29 -4.496,-7.62; 30 -3.988,-7.62; 31 -3.505,-7.62; 32 -2.997,-7.62; 33 -2.489,-7.62; 34 -2.007,-7.62; 35 -1.499,-7.62; 36 -0.991,-7.62; 37 -0.508,-7.62; 38 0,-7.62; 39 0.508,-7.62; 40 0.991,-7.62; 41 1.499,-7.62; 42 2.007,-7.62; 43 2.489,-7.62; 44 2.997,-7.62; 45 3.505,-7.62; 46 3.988,-7.62; 47 4.496,-7.62; 48 5.004,-7.62; 49 5.512,-7.62; 50 5.994,-7.62; 76 5.994,7.62; 77 5.512,7.62; 78 5.004,7.62; 79 4.496,7.62; 80 3.988,7.62; 81 3.505,7.62; 82 2.997,7.62; 83 2.489,7.62; 84 2.007,7.62; 85 1.499,7.62; 86 0.991,7.62; 87 0.508,7.62; 88 0,7.62; 89 -0.508,7.62; 90 -0.991,7.62; 91 -1.499,7.62; 92 -2.007,7.62; 93 -2.489,7.62; 94 -2.997,7.62; 95 -3.505,7.62; 96 -3.988,7.62; 97 -4.496,7.62; 98 -5.004,7.62; 99 -5.512,7.62; 100 -5.994,7.62
DFN10 = smd 0.686 x 0.254: 1 -1.42,1; 2 -1.42,0.5; 3 -1.42,0; 4 -1.42,-0.5; 5 -1.42,-1; 6 1.42,-1; 7 1.42,-0.5; 8 1.42,0; 9 1.42,0.5; 10 1.42,1 | smd 1.6 x 2.3: EP 0,0
TSOT5_MC = smd 1.321 x 0.559: 1 -1.168,0.94; 2 -1.168,0; 3 -1.168,-0.94; 4 1.168,-0.94; 5 1.168,0.94
TSSOP20_MC = smd 1.473 x 0.356: 1 -2.819,2.921; 2 -2.819,2.286; 3 -2.819,1.626; 4 -2.819,0.965; 5 -2.819,0.33; 6 -2.819,-0.33; 7 -2.819,-0.965; 8 -2.819,-1.626; 9 -2.819,-2.286; 10 -2.819,-2.921; 11 2.819,-2.921; 12 2.819,-2.286; 13 2.819,-1.626; 14 2.819,-0.965; 15 2.819,-0.33; 16 2.819,0.33; 17 2.819,0.965; 18 2.819,1.626; 19 2.819,2.286; 20 2.819,2.921
SOIC14-N_MC = smd 1.981 x 0.559: 1 -2.362,3.81; 2 -2.362,2.54; 3 -2.362,1.27; 4 -2.362,0; 5 -2.362,-1.27; 6 -2.362,-2.54; 7 -2.362,-3.81; 8 2.362,-3.81; 9 2.362,-2.54; 10 2.362,-1.27; 11 2.362,0; 12 2.362,1.27; 13 2.362,2.54; 14 2.362,3.81
SOT-23_MC = smd 0.991 x 1.321: 1 -0.94,-1.016; 2 0.94,-1.016; 3 0,1.016
CS10 = smd 1.9 x 2.4: P$1 2.25,0; P$2 -2.25,0

### Placement (x,y rotation side)
C1  23.67,37.87 0 top
C2  6.81,34.01 0 top
C3  15.95,29.9 180 top
C4  10.26,41.4 270 top
C5  12.6,41.4 270 top
C6  63.55,22.5 90 top
C7  58.42,22.86 90 top
C8  66.85,22.5 90 top
C9  50.8,33.02 0 top
C10  52.07,39.37 0 top
C11  65.07,46.18 90 top
C12  62.81,46.08 270 top
C13  76.07,33.35 180 top
C14  17.78,54 90 top
C15  20.68,53.98 90 top
C16  19.58,48.82 270 top
C17  10.21,30.53 0 top
C18  15.24,10.16 0 top
C19  11.43,15.24 90 top
C20  48.26,67.31 270 top
C21  37.34,67.31 90 top
C22  56.13,19.05 90 top
C23  61.54,22.53 270 top
C24  86.36,17.78 270 top
C25  83.82,17.78 90 top
C26  36.83,36.83 180 top
C27  36.83,31.55 0 top
C54  84.35,37.82 270 top
C55  84.35,34.77 90 top
CONN1  7.62,53.34 0 top
D1  16.51,63.5 0 top
D2  19.05,60.96 0 top
D3  21.59,63.5 0 top
D4  24.13,60.96 0 top
D5  72.39,54.61 0 top
D6  69.85,57.15 0 top
D7  67.31,54.61 0 top
D8  64.77,57.15 0 top
D9  62.23,54.61 0 top
D10  59.69,57.15 0 top
D11  57.15,54.61 0 top
D12  54.61,57.15 0 top
D13  80.01,44.45 270 top
D14  84.35,46.99 270 top
D15  80.01,49.53 270 top
D16  84.35,52.07 270 top
D17  80.01,54.61 270 top
D18  84.35,57.15 270 top
D19  80.01,59.69 270 top
D20  84.35,62.23 270 top
D21  10.67,64.47 90 top
ICSP1  41.91,2.54 0 top
J1  44.45,46.99 90 top
J2  5.08,64.77 270 top
J3  19.05,69.85 0 top
J4  95.25,53.34 270 top
J5  63.5,69.85 0 top
L1  14.91,35.31 0 top
L2  21.59,13.97 0 top
LED1  93.98,17.78 90 top
LED2  93.98,20.32 90 top
LED3  93.98,22.86 90 top
LED4  93.98,25.4 90 top
LED5  93.98,27.94 90 top
LED6  93.98,30.48 90 top
LED7  93.98,33.02 90 top
LED8  93.98,35.56 90 top
M1  3.81,3.81 0 top
M2  3.81,72.39 0 top
M3  97.79,72.39 0 top
M4  97.79,3.81 0 top
R1  72.9,6.63 270 top
R3  23.65,31.52 0 top
R4  49.53,44.45 0 top
R5  49.53,46.99 0 top
R6  49.53,49.53 0 top
R7  49.53,52.07 0 top
R8  49.53,41.91 0 top
R9  45.72,38.1 180 top
R10  8.28,37.31 180 top
R11  16.64,43.92 180 top
R12  43.18,17.78 0 top
R13  43.18,20.32 0 top
R14  80.77,24.99 0 top
R15  80.8,22.83 0 top
R16  43.31,25.4 0 top
R17  5.08,27.94 90 top
R18  10.16,24.77 180 top
R19  45.72,59.69 90 top
R20  43.18,59.69 90 top
R21  38.1,59.69 90 top
R22  40.46,59.74 270 top
R23  27.94,59.69 90 top
R24  30.48,59.69 270 top
R25  33.02,59.69 90 top
R26  35.56,59.69 90 top
R27  97.79,17.78 0 top
R28  97.79,20.32 0 top
R29  97.79,22.86 0 top
R30  97.79,25.4 0 top
R31  97.79,27.94 0 top
R32  97.79,30.48 0 top
R33  97.79,33.02 0 top
R34  97.79,35.56 0 top
R35  81.28,17.78 270 top
R36  36.83,34.29 180 top
R37  72.39,63.5 270 top
R38  69.85,63.5 270 top
R39  67.31,63.5 270 top
R40  64.77,63.5 270 top
R41  62.23,63.5 270 top
R42  59.69,63.5 270 top
R43  57.15,63.5 270 top
R44  54.61,63.5 270 top
R45  90.17,44.45 180 top
R46  90.17,46.99 180 top
R47  90.17,49.53 180 top
R48  90.17,52.07 180 top
R49  90.17,54.61 180 top
R50  90.17,57.15 180 top
R51  90.17,59.69 180 top
R52  90.17,62.23 180 top
RPI1  85.09,7.62 270 top
U1  20.73,35.61 0 top
U2  63.5,34.29 0 top
U3  16.66,46.38 0 top
U4  10.16,27.94 0 top
U5  15.24,13.97 0 top
U6  43.18,67.31 90 top
U7  31.75,67.31 270 top
U8  59.99,17.5 180 top
U$1  63.37,33.83 0 bottom
Y1  80.54,36.3 270 top

### Tracks (layer width: path | path; a pad name or v marks a point on that pad's centre or on a via)
5V_POWER_GOOD  (via drill 0.51)
  Top 0.241: U1.8 21.48,32.84 R3.1
  Top 0.254: R3.1 26.09,34.81 26.09,37.62 v35.1,46.63 | U2.19 57.35,31.29 v57.4,31.24
  Bottom 0.254: v57.4,31.24 55.88,32.77 45.41,32.77 41.76,36.42 41.76,37.82 35.1,44.48 v35.1,46.63
+3V3  (via drill 0.51)
  Top 0.254: U4.10 11.58,29.52 11.53,29.57 11.07,29.57 11.06,29.58 C17.2 | 73.69,33.73 74.07,33.35 74.22,33.35 | 74.22,33.35 C13.2 | R35.1 80.43,18.63 v79.68,17.88 | 63.88,43.92 64.49,43.31 U2.86 64.49,40.31 | 59.51,28.02 U2.30 59.51,23.71 | C6.2 63.48,23.43 63.48,24.56 62.99,25.04 U2.37 62.99,27.56 63.25,27.81 63.25,27.94 63.45,28.14 | 63.48,27.81 63.86,28.19 | C8.2 66.85,24.33 67.49,24.97 U2.46 67.49,28.32 67.21,28.32 | U2.62 73.79,33.78 74.22,33.35 | U2.2 57.76,39.8 57.78,39.83 | C22.2 57.61,19.9 v57.61,17.25 | v61.77,20.17 60.94,19.33 U8.1 | 59.51,23.71 59.51,23.7 | C7.2 59.51,23.71
  Bottom 0.254: v79.68,17.88 76.63,17.88 v76.61,17.91 | v81.05,48.03 v81.05,45.97 | 81.05,48.06 81,48.11 81,48.08 81.08,48.01 | v55.98,58.22 56.01,58.19 | v61.14,58.22 61.16,58.22 | v57.61,17.25 58.85,17.25 v61.77,20.17 | 20.57,55.47 v20.57,58.17 | 73.58,58.27 73.61,58.24 | v71.37,58.27 71.4,58.27 | v58.22,51.89 58.22,51.87
  Bottom 0.813: v81.05,61.27 v81.05,58.27 v81.05,56.06 v81.05,53.09 v81.05,51.03 v81.05,48.03 | v81.05,45.97 81.05,48.06 | 56.01,58.19 57.61,59.79 59.56,59.79 v61.14,58.22 | 61.16,58.22 62.84,59.89 64.69,59.89 v66.29,58.29 67.56,59.56 70.08,59.56 v71.37,58.27 | 58.22,51.87 55.98,54.1 v55.98,58.22 | v23.06,64.47 23.06,64.52 21.57,66.02 19.48,66.02 18.01,64.54 v17.98,64.54 | v22.35,53.7 20.57,55.47 | 71.4,58.27 73.58,58.27
  other vias: 73.58,58.24
  pour Top: 15.75,74.93 100.33,74.93 100.33,1.27 26.37,1.04 16.18,0.99 16.18,13.82 25.83,13.82 26.67,14.63 26.67,26.72 25.27,26.72 25.27,26.67 10.49,26.57 10.49,31.01 19.41,31.01 19.43,31.04 21.92,31.04 26.04,35.2 26.04,42.85 15.72,42.85 15.72,53.72 15.75,53.85
+5V  (via drill 0.51)
  Top 0.254: 11.43,16 C19.2 11.43,16.26 | 5.11,25.81 5.08,25.83 R17.1 5.21,26.67 5.77,26.67 7.54,28.44 U4.2 | v5.08,12.7 v6.35,12.7 | 5.11,12.57 5.11,12.68 v5.08,12.7 | v5.08,12.7 v5.08,13.97 | v5.08,15.24 v6.35,15.24 | v5.08,16.51 v6.35,16.51 | v5.08,17.78 v6.35,17.78 v6.35,19.05 v5.08,19.05 | v6.35,22.86 v5.08,22.86 | v3.81,21.59 v5.08,21.59 | 5.11,24.49 5.11,24.56
  Top 1.27: 5.11,24.56 5.11,25.81 | v6.35,19.05 v6.35,20.32 v5.08,20.32 v3.81,20.32 v3.81,21.59 | v5.08,12.7 v3.81,12.7 | v5.08,13.97 v3.81,13.97 | v3.81,15.24 v5.08,15.24 | v3.81,16.51 v5.08,16.51 | v5.08,17.78 v3.81,17.78 | v3.81,19.05 v5.08,19.05 | v6.35,22.86 v6.35,24.13 5.11,24.13 v5.08,24.13 v3.81,24.13 | v5.08,22.86 v3.81,22.86 | v5.08,21.59 v6.35,21.59
  Top 3.81: 5.11,12.57 5.11,24.13 5.11,24.49
  Bottom 0.241: 81.89,5.28 81.92,5.28
  Bottom 0.254: 83,8.79 RPI1.P1-2 | 81.89,9.04 81.89,9.96
  Bottom 1.27: RPI1.P1-2 RPI1.P1-4 | 83,8.79 81.89,9.89 81.89,9.96 81.89,10.16 81.94,10.21 83.01,10.21
  Bottom 3.81: v5.08,24.13 5.08,11.96 12.68,4.37 26.92,4.37 29.11,6.55 50.85,6.55 52.12,5.28 81.89,5.28 81.89,9.04
  other vias: 6.35,13.97
  pour Top (no thermals): 6.35,17.78 6.35,12.7 13.89,12.7 13.92,16.33 12.5,17.78
+5V_BULK
  Top 0.241: U1.5 19.98,32.12 19.19,31.33
  Top 0.254: 8.12,32.31 7.76,32.67 | 15,32.22 L1.2 15.49,31.72 15.49,31.57 15.73,31.33 19.19,31.33 | 5.59,29.77 5.16,29.34 R17.2 5.08,28.96 8.72,28.96 U4.1
  Top 0.813: 15,32.22 C3.2
  Top 1.27: L1.2 8.12,32.31 arc90 5.59,29.77 | 7.76,32.67 C2.2
ADDR_SEL2
  Top 0.254: R20.2 43.96,60.54 45.66,58.84 R19.1 | U6.4 42.22,63.68 42.52,63.37 42.75,63.37 43.31,62.81 43.31,61.98 43.18,61.85 R20.2 | R20.2 43.18,61.32
ADDR_SEL3  (via drill 0.51)
  Top 0.254: U6.16 42.85,71.42 v44.2,72.77 | R21.1 38.15,58.89 R22.2 40.16,58.89 v40.16,55.42
  Bottom 0.254: v44.2,72.77 46.1,72.77 47.7,71.17 47.7,68.58 49.94,66.34 49.94,60.5 47.62,58.19 42.93,58.19 v40.16,55.42
ALERT_N  (via drill 0.51)
  Top 0.241: 19.66,45.09 18.86,45.88 U3.7
  Top 0.254: U4.7 12.34,27.44 13.7,26.07 13.7,25.67 14.33,25.04 15.14,25.04 16,25.91 17.25,25.91 v18.06,26.72 41.14,26.72 R16.1 42.46,23.97 v42.42,23.93 | v23.09,45.92 22.25,45.09 19.66,45.09 | v52.93,25.63 52.38,26.19 52.38,30.5 53.67,31.8 U2.18
  Bottom 0.254: v18.06,26.72 20.04,26.72 25.98,32.66 25.98,43.03 v23.09,45.92 | v52.93,25.63 51.23,23.93 v42.42,23.93
ANALOG0  (via drill 0.51)
  Top 0.254: v36.63,69.44 36.63,69.34 35.56,69.34 U7.1 | v47.73,64.19 46.1,64.19 U6.10 | U2.25 55.47,28.3 55.47,27.38 v54.74,26.64 | v42.09,28.4 42.09,31.19 39.5,33.78 39.5,41.99 36.97,44.51 36.97,49.16 35.59,50.55 34.65,50.55 34.52,50.42 v33.6,50.42
  Bottom 0.254: v47.73,64.19 47.73,66.57 44.96,69.34 36.63,69.34 v36.63,69.44 arc-90 36.52,69.34 26.47,69.34 25.4,68.28 25.4,66.47 26.26,65.61 26.59,65.61 28.19,64.01 28.19,62.53 29.26,61.47 30.53,61.47 31.9,60.1 31.9,51.89 33.38,50.42 v33.6,50.42 | v54.74,26.64 54.08,26.64 54,26.57 53.06,26.57 52.88,26.75 43.74,26.75 v42.09,28.4
ANALOG0_IN  (via drill 0.51)
  Top 0.254: J3.2 D1.3 16.51,57.51 18.01,56.01 21.54,56.01 26.36,51.18 30.18,51.18 31.5,52.5 v34.85,52.5 | U6.8 44.81,62.48 v44.78,62.46
  Bottom 0.254: v44.78,62.46 34.82,52.5 v34.85,52.5
ANALOG1  (via drill 0.51)
  Top 0.254: v37.34,64.52 40.13,64.52 40.16,64.49 U6.1 40.26,63.42 41.4,62.28 41.4,37.59 46.09,32.91 46.09,30.9 v48.46,28.52 | 27.94,69.6 U7.7 27.89,69.62 27.89,68.91 26.85,67.87 v26.85,67.23 | U2.24 53.95,28.78 53.67,28.5 v53.67,27.51
  Bottom 0.254: v37.34,64.52 31.45,64.52 31.45,64.49 29.59,64.49 v26.85,67.23 | v53.67,27.51 49.48,27.51 v48.46,28.52
ANALOG1_IN  (via drill 0.51)
  Top 0.254: J3.3 D2.3 19.05,57.84 v19.2,57.68 | U6.3 41.55,63.27 v42.37,62.46 | v33.88,53.75 30.91,53.75 29.62,52.45 v27.66,52.45
  Bottom 0.241: 21.16,52.45 19.2,54.41 v19.2,57.68
  Bottom 0.254: 21.16,52.45 v27.66,52.45 | v33.88,53.75 42.37,62.23 v42.37,62.46
ANALOG2  (via drill 0.51)
  Top 0.254: R24.2 30.48,57.23 v30.45,57.2 | U2.23 57.48,29.29 v57.96,29.77 | v26.59,63.2 27.46,63.2 27.94,63.68 U7.8
  Bottom 0.254: v57.96,29.77 57.2,29.01 51.89,29.01 51.41,29.01 51.38,29.01 50.29,30.1 44.32,30.1 43.99,29.77 41.38,29.77 32.56,38.58 32.56,48.51 30.45,50.62 30.45,57.17 | 30.45,57.17 v30.45,57.2 | 30.45,57.17 26.59,61.04 v26.59,63.2
ANALOG2_IN
  Top 0.254: J3.4 D3.3 21.59,57.17 23.62,55.14 25.48,55.14 27.94,57.61 R23.1
ANALOG3  (via drill 0.51)
  Top 0.254: U7.14 R26.2 35.56,60.45 37.01,59 37.01,50.7 37.57,50.14 37.57,44.98 40.11,42.44 40.11,42.14 40.08,42.11 40.08,34.09 v43.43,30.73 | U2.22 54.53,29.79 v54.36,29.97
  Bottom 0.254: v54.36,29.97 53.59,30.73 v43.43,30.73
ANALOG3_IN  (via drill 0.51)
  Top 0.254: 33.02,58.93 R25.1 33.02,57.76 29.82,54.56 v27.03,54.56 | J3.5 D4.3 24.13,57.45 v24.84,56.74
  Bottom 0.254: v24.84,56.74 v27.03,54.56
BOOST
  Top 0.241: U1.10 22.68,35.36
  Top 0.254: C1.2 24.52,36.95 25.09,36.37 25.09,34.7 24.33,33.93 23.67,33.93 23.09,34.52 23.09,35.1 22.84,35.36 U1.10
GND  (via drill 0.51)
  Top 0.241: R11.2 15.24,44.46 U3.5 14.7,45.38 v14.38,45.06 | 17.2,46.84 v17.2,48.49
  Top 0.254: 61.19,53.42 61.34,53.57 D9.1 61.28,53.28 60.94,52.93 60.94,51.18 v60.68,50.93 | v56.29,51.31 56.29,53.59 | 56.29,53.59 56.34,53.65 | v53.06,58.12 53.06,56.74 53.7,56.11 53.7,56.09 D12.1 | v58.22,58.17 58.22,56.57 58.7,56.08 58.71,56.08 D10.1 | C24.1 v86.36,20.5 | C8.1 66.88,21.63 v66.88,20.3 | C6.1 v63.55,20.37 | C9.1 49.95,34.1 arc90 v49.94,34.11 | U2.75 71.73,40.28 v72.36,40.92 | v77.22,45.44 78.87,45.44 D13.1 | v77.34,50.47 D15.1 | v77.24,55.5 78.85,55.5 D17.1 | v77.22,60.68 78.87,60.68 D19.1 | v85.11,53.57 83.8,53.57 D16.1 | v66.37,51.41 D7.1 | v68.3,58.22 68.3,56.65 D6.1 | v63.22,58.22 63.22,56.65 D8.1 | 56.29,53.59 56.28,53.59 D11.1 | U7.13 34.29,62.94 v34.27,62.92 | v47.78,60.58 45.76,60.58 R19.2 | v38.08,62.2 38.08,60.56 R21.2 | v49.28,69.67 49.28,69.18 C20.1 48.2,68.16 47.83,68.53 45.03,68.53 44.81,68.76 U6.13 | U6.18 U6.17 42.22,72.67 v42.19,72.67 | v20.17,64.57 20.17,62.87 D3.1 | v23.09,57.94 23.09,59.77 D4.1 | D1.1 15.54,62.38 v15.54,60.71 | C14.1 17.78,51.23 v17.75,51.21 | C15.1 20.68,51.18 v20.62,51.13 | v37.85,38.71 37.85,36.87 37.82,36.87 C26.1 | 11.41,14.28 C19.1 11.66,14.29 | R18.2 9.26,24.71 v7.92,24.71 | 10.08,26.92 8.76,26.92 U4.5 | v10.06,26.14 10.06,26.9 10.08,26.92 | C17.1 v8,30.53 | v85.11,58.6 83.75,58.6 D18.1 | v85.11,48.51 83.83,48.51 D14.1 | D5.1 71.44,52.21 v71.04,51.82 | C54.2 82.66,36.97 v82.58,37.06 | C55.2 84.19,35.79 v82.58,35.79 | C13.1 76.95,33.38 v78.18,33.38 | U2.45 67,25.58 66.52,25.09 v65.68,25.09 | 21.03,36.12 20.98,36.12 U1.14 20.83,37.09 20.73,37.19 20.63,37.09 U1.15 20.48,35.61 U1.ECP | U3.5 16.27,45.38 16.56,45.67 16.56,46.28 U3.EP | C16.1 19.58,50.49 v19.13,50.95
  Top 0.254: 15.29,14.2 15.29,16.43 v15.24,16.48 | 11.68,12.78 v11.66,12.78 10.03,12.78 | 10.03,13.74 10.03,13.77 | 11.63,13.36 11.63,13.61 11.79,13.77 | U7.11 v31.75,66.73 | C21.1 37.43,66.37 v38.71,66.37 | U2.15 54.61,33.3 v54.08,33.83 | 10.08,26.92 10.16,27 U4.EP | v9.37,12.78 9.37,13.08 | v62.23,48.11 62.23,47.51 C12.1 | v64.75,48.31 64.75,47.46 C11.2 | v56.13,16.69 C22.1 | U8.3 59.51,16 v58.55,16 | U2.31 59.99,25.22 60.4,24.82 v60.96,24.82 60.96,23.88 61.46,23.38 C23.1 | 11.51,49.96 11.46,50.01 v11.46,50.09 | CONN1.3 11.51,47.63 | CONN1.2 5.33,47.55 | v18.09,58.47 18.09,59.84 D2.1 | v57.07,22 57.09,22.01 C7.1 | v62.28,28.19 62.51,27.96 U2.36 | 51.14,39.29 arc90 C10.1 51.22,39.29 v49.86,39.29 | U2.65 72.95,35.28 v73.46,35.79 | v83.19,64.67 83.19,63.25 D20.1 | U7.9 29.21,62.81 v29.23,62.79
  Top 0.762: 20.73,37.19 v20.73,38
  Top 0.813: v18.31,30.4 v18.31,29.26 18.31,29.9 C3.1 | 4.39,34.01 v4.39,34.67 | 4.39,34.01 C2.1 | 10.03,13.77 11.79,13.77 | v4.39,33.55 4.39,34.01
  Top 1.27: v9.37,12.78 v11.66,12.78 11.66,14.29 | 10.03,12.78 10.03,13.74 9.37,13.08 | 11.63,13.36 10.49,13.36 | v10.79,51.1 10.85,51.16 12.24,51.16 12.85,50.55 12.85,50.11 12.75,50.01 v10.01,50.01 10.01,50.34 10.79,51.13
  Top 2.54: 11.51,47.63 11.51,49.96
  Top 3.81: 5.33,47.55 v5.33,49.53
  Bottom 0.254: v66.88,20.3 66.85,20.32
  other vias: 14.05,11.66 16.69,33.45 17.81,33.27 19.02,33.3 17.22,32.38 18.44,32.33 10.9,43.81 12.17,43.79 13.54,43.81 4.04,49.53 6.65,49.5 12.24,51.18 12.85,50.09 13.69,18.24 15.19,18.26 16.59,18.34 14.45,17.35 15.95,17.4 16.79,16.54 12.88,11.66 15.14,11.66 12.88,8.13 15.14,8.61 13.97,8.61 10.01,13.77 10.54,12.78 12.88,10.54 12.88,9.35 9.37,67.94 10.54,67.94 11.73,67.94 9.35,69.19 10.52,69.19 11.71,69.19 9.35,70.41 10.52,70.41 11.71,70.41 4.67,50.55 6.05,50.57
  pour Bottom: 1.27,74.93 100.33,74.93 100.33,1.27 1.27,1.27
  pour Top (no thermals): 19.15,34.87 19.94,34.9 19.81,34.77 19.81,34.75 19.74,34.75 19.56,34.57 19.56,32.21 18.97,31.62 16.31,31.62 16.1,31.83 16.1,33.66 16.43,33.99 18.26,33.99
  pour Top: 12.7,19.05 12.7,18.31 14.61,16.41 14.61,12.85 14.2,12.12 12.6,12.12 12.45,11.96 12.45,7.85 12.9,7.52 15.62,7.52 15.62,12.73 15.39,12.88 15.39,14.4 17.37,16.1 17.4,19.08 13,19.05
  pour Top: 9.68,41.83 13.92,41.83 13.92,43.74 13.49,44.17 10.87,44.17 9.68,42.98
  pour Top: 9.09,71.5 8.28,70.69 8.28,66.73 9.86,65.15 11.43,65.15 13.03,66.75 13.03,70.61 12.14,71.5 9.12,71.5
I2C1_SCL  (via drill 0.51)
  Top 0.254: U2.66 69.93,35.79 69.6,35.46 v69.6,33.27 | 77.92,16.15 RPI1.P1-5 | v76.02,16.15 77.92,16.15 | 77.92,16.15 77.92,22.99 R14.1 78.63,26.29 v78.63,29.55
  Bottom 0.254: v69.6,33.27 71.63,31.24 76.96,31.24 78.63,29.58 v78.63,29.55 | v44.96,16.51 47.6,13.87 51.92,13.87 51.99,13.95 62.08,13.95 63.75,15.62 75.49,15.62 v76.02,16.15
I2C1_SDA  (via drill 0.51)
  Top 0.254: R15.1 79.95,23 | v80.37,30.02 80.37,27.69 81.56,26.49 82.75,26.49 83.52,25.73 83.52,22.5 82.91,21.89 80.9,21.89 R15.1 | R15.1 78.64,21.53 78.64,14.58 RPI1.P1-3 | U2.67 72.67,36.3 73.46,37.08 v75.77,37.08
  Bottom 0.254: v80.37,30.02 80.37,33.96 77.24,37.08 v75.77,37.08
I2C2_SCL  (via drill 0.51)
  Top 0.241: 21.16,28.45 23.39,28.45 v23.9,28.96 | 18.82,27.64 19.13,27.33
  Top 0.254: v42.67,19.05 42.67,18.12 R12.1 | U2.58 69.85,31.8 69.39,31.34 v69.39,29.23 | 19.13,27.33 20.04,27.33 21.16,28.45 | U6.5 42.85,65.66 v42.29,66.22 | v34.92,49.61 32.74,47.42 v24.26,47.42 21.13,47.42 20.59,46.88 U3.9 | v32.49,29.23 28.4,29.23 28.12,28.96 v23.9,28.96 | U4.9 13.04,28.44 14.61,26.87 15.24,26.87 15.67,26.44 16.41,26.44 17.6,27.64 18.82,27.64
  Bottom 0.254: v42.29,66.22 39.93,63.86 39.93,62.18 32.41,54.66 32.41,52.32 33.35,51.38 33.91,51.38 34.92,50.37 v34.92,49.61 | v32.49,29.23 v42.67,19.05 43.31,18.41 57.68,18.41 67.64,28.37 68.5,28.37 69.37,29.23 v69.39,29.23 | v23.9,28.96 26.64,31.7 26.64,45.03 v24.26,47.42
I2C2_SDA  (via drill 0.51)
  Top 0.241: 21.61,46.35 22.17,46.91 23.42,46.91 23.9,46.43 24.89,46.43
  Top 0.254: 45.64,20.32 v45.64,20.3 44.68,21.26 43.31,21.26 42.37,20.32 R13.1 41.8,20.85 v37.92,20.85 | v68.58,32.28 U2.59 | U4.8 12.12,27.94 12.78,27.94 12.8,27.94 v14.78,25.96 | v16.48,24.21 v34.57,24.21 | U6.6 43.51,65.89 v43.81,66.19 | v35.74,48.26 34.54,48.26 33.15,46.86 25.32,46.86 24.89,46.43 | v21.57,46.35 21.61,46.35 | v21.57,46.35 21.54,46.38 | U3.8 20.32,46.38 20.47,46.23 21.44,46.23 v21.57,46.35
  Bottom 0.254: v45.64,20.3 49.76,20.3 54.13,24.66 55.32,24.66 62.94,32.28 v68.58,32.28 | v16.48,24.21 14.76,25.93 v14.78,25.96 16.66,27.84 20.22,27.84 25.48,33.1 25.48,40.87 21.57,44.78 v21.57,46.35 | v34.57,24.21 v37.92,20.85 | v43.81,66.19 40.79,63.17 40.79,62.31 32.92,54.43 32.92,52.63 33.58,51.97 34.11,51.97 35.2,50.88 35.33,50.88 36.02,50.19 36.02,48.54 v35.74,48.26 35.79,48.26
INOUT00
  Top 0.254: R45.2 D13.3 72.34,44.45 70.59,42.7 69.83,42.7 69.49,42.37 U2.76
INOUT00_R
  Top 0.254: R45.1 J4.9
INOUT01
  Top 0.254: R46.2 D14.3 75.39,46.99 74.09,46.99 70.36,43.26 69.42,43.26 69.01,42.85 U2.77
INOUT01_R
  Top 0.254: R46.1 J4.8
INOUT02
  Top 0.254: R47.2 89.32,49.54 88.95,49.91 81.49,49.91 D15.3 75.82,49.53 70.1,43.81 69.04,43.81 68.5,43.28 U2.78
INOUT02_R
  Top 0.254: R47.1 J4.7
INOUT03
  Top 0.254: 89.41,52.07 R48.2 D16.3 77.72,52.07 77.65,52.07 77.62,52.07 69.88,44.32 68.4,44.32 67,42.93 U2.81
INOUT03_R
  Top 0.254: R48.1 J4.6
INOUT04
  Top 0.254: R49.2 88.92,54.61 88.92,54.99 81.49,54.99 D17.3 80.93,54.79 80.78,54.63 78.13,54.63 77.7,54.2 77.7,52.91 69.62,44.83 68.17,44.83 66.5,43.16 U2.82
INOUT04_R
  Top 0.254: R49.1 J4.5
INOUT05
  Top 0.254: R50.2 D18.3 77.6,57.15 76.3,55.85 76.3,55.09 77.17,54.23 77.17,53.11 69.39,45.34 67.94,45.34 65.99,43.38 U2.83
INOUT05_R
  Top 0.254: R50.1 J4.4
INOUT06
  Top 0.254: 81.5,60.08 D19.3 77.88,59.69 75.69,57.51 75.69,54.81 76.61,53.9 76.61,53.34 69.19,45.92 67.77,45.92 65.51,43.66 U2.84 | 81.5,60.08 81.53,60.08 81.54,60.07 86.84,60.07 87.22,59.69 R51.2 89.33,59.69 | 81.5,60.08 81.52,60.1
INOUT06_R
  Top 0.254: R51.1 J4.3
INOUT07  (via drill 0.51)
  Top 0.254: 85.62,62.23 R52.2 | 85.62,62.23 D20.3 | v83.82,40.64 76.2,40.64 72.34,36.78 U2.68 | 85.62,62.23 86.36,62.97 v86.36,63.5
  Bottom 0.254: v86.36,63.5 86.36,43.18 v83.82,40.64
INOUT07_R
  Top 0.254: R52.1 J4.2
INOUT08  (via drill 0.51)
  Top 0.254: R37.2 D5.3 v72.39,50.98 | U2.93 61.01,40.41 v61.04,40.39
  Bottom 0.254: v61.04,40.39 61.04,43.28 62.94,45.19 66.6,45.19 v72.39,50.98
INOUT08_R
  Top 0.254: R37.1 J5.9
INOUT09  (via drill 0.51)
  Top 0.254: R38.2 D6.3 v69.85,50.8 | U2.94 60.5,44.04 v60.98,44.53
  Bottom 0.254: v69.85,50.8 69.85,49.23 66.5,45.87 62.33,45.87 v60.98,44.53
INOUT09_R
  Top 0.254: R38.1 J5.8
INOUT10  (via drill 0.51)
  Top 0.254: R39.2 D7.3 v67.31,49.91 | U2.98 58.5,40.87 v59.05,40.31
  Bottom 0.254: v59.05,40.31 59.05,46.51 62.46,49.91 v67.31,49.91
INOUT10_R
  Top 0.254: R39.1 J5.7
INOUT11  (via drill 0.51)
  Top 0.254: R40.2 D8.3 v64.77,52.12 | U2.99 v57.99,44.78
  Bottom 0.254: v64.77,52.12 64.77,51.18 64.21,50.62 62.43,50.62 57.99,46.18 v57.99,44.78
INOUT11_R
  Top 0.254: R40.1 J5.6
INOUT12  (via drill 0.51)
  Top 0.254: R41.2 D9.3 v62.23,51.92 | U2.100 57.07,41.91 56.84,42.14 v56.84,43.69
  Bottom 0.254: v56.84,43.69 56.84,45.77 62.23,51.16 v62.23,51.92 62.23,51.18
INOUT12_R
  Top 0.254: R41.1 J5.5
INOUT13  (via drill 0.51)
  Top 0.254: R42.2 D10.3 v59.69,52.38 | U2.3 54.79,39.29 54.53,39.55 54.53,42.24 54.08,42.7 v53.31,42.7
  Bottom 0.254: v59.69,52.38 59.69,50.29 53.29,43.89 53.31,43.87 v53.31,42.7
INOUT13_R
  Top 0.254: R42.1 J5.4
INOUT14  (via drill 0.51)
  Top 0.254: R43.2 D11.3 57.15,51.74 57.3,51.59 57.3,49.96 v56.46,49.12 | U2.4 57.81,38.79 58.19,38.41 58.67,38.41 59.11,37.97 60.15,37.97 v60.2,37.92
  Bottom 0.254: v60.2,37.92 59.49,38.63 57.91,38.63 55.6,40.95 49.43,40.95 48.69,40.21 42.11,40.21 39.42,42.9 39.42,52.07 42.09,54.74 49.17,54.74 51.89,52.02 53.57,52.02 v56.46,49.12
INOUT14_R
  Top 0.254: R43.1 J5.3
INOUT15  (via drill 0.51)
  Top 0.254: R44.2 D12.3 v54.61,52.58 | v58.29,37.49 57.51,38.28 U2.5
  Bottom 0.254: v54.61,52.58 52.12,52.58 49.45,55.24 41.86,55.24 38.81,52.2 38.81,42.77 41.88,39.7 48.97,39.7 49.48,40.21 53.31,40.21 53.59,39.93 55.85,39.93 v58.29,37.49
INOUT15_R
  Top 0.254: R44.1 J5.2
JTAG_TCK  (via drill 0.51)
  Top 0.254: RPI1.P1-22 58.93,11.56 60.81,11.56 61.42,12.17 61.42,13.46 63.6,15.65 v63.6,17.12 | v65.25,18.77 65.25,23.88 63.5,25.63 U2.38
  Bottom 0.254: v63.6,17.12 v65.25,18.77
JTAG_TDI  (via drill 0.51)
  Top 0.254: v83.97,20.68 84.66,21.36 84.66,28.5 81.86,31.29 73.25,31.29 72.64,31.9 72.64,32.51 72.36,32.79 U2.60 | RPI1.P1-15 66.47,11.51 70.79,11.51 71.58,12.29 71.58,14.94 v76.15,19.51
  Bottom 0.254: v76.15,19.51 77.32,20.68 v83.97,20.68
JTAG_TDO
  Top 0.241: 66.47,8.97 70.74,8.97 71.58,9.8
  Top 0.254: U2.61 72.72,33.3 73.2,32.82 73.2,32.08 73.43,31.85 83.92,31.85 87.16,28.61 87.45,28.32 88.75,27.03 88.75,15.04 85.14,11.43 72.06,11.43 71.58,10.95 71.58,9.8 | RPI1.P1-16 66.47,8.97
JTAG_TMS  (via drill 0.51)
  Top 0.254: v53.8,11.53 53.8,14.86 52.58,16.08 52.58,21.72 51.33,22.96 51.33,30.61 53.01,32.28 U2.17
  Bottom 0.254: RPI1.P1-18 61.37,11.53 v53.8,11.53
LED1_N  (via drill 0.51)
  Top 0.254: LED1.C 90.98,17.78 v90.96,17.75 | U2.47 68,24.36 69.42,22.94 69.42,22.4 69.93,21.89 70.46,21.89 71.02,21.34 v71.09,21.34
  Bottom 0.254: v90.96,17.75 89.74,18.97 89.74,20.8 88.62,21.92 71.68,21.92 v71.09,21.34
LED2_N  (via drill 0.51)
  Top 0.254: U2.48 68.5,24.61 v70.33,22.78 | LED2.C 91.01,20.32 v90.98,20.34
  Bottom 0.254: v90.98,20.34 88.88,22.45 70.66,22.45 v70.33,22.78
LED3_N  (via drill 0.51)
  Top 0.254: U2.49 69.01,24.89 70.05,23.85 v71.27,23.85 | v90.93,22.86 LED3.C
  Bottom 0.254: v90.93,22.86 89.84,22.86 89.59,23.11 72.01,23.11 v71.27,23.85
LED4_N  (via drill 0.51)
  Top 0.254: U2.50 69.49,26.01 v70.48,25.02 | LED4.C 90.96,25.4 v90.93,25.38
  Bottom 0.254: v70.48,25.02 71.55,25.02 72.95,23.62 89.18,23.62 v90.93,25.38
LED5_N  (via drill 0.51)
  Top 0.254: U2.51 72.59,28.3 74.98,25.91 v74.98,25.86 | LED5.C 90.83,27.94 v90.81,27.96
  Bottom 0.254: v74.98,25.86 85.06,25.86 87.1,27.89 90.73,27.89 v90.81,27.96
LED6_N  (via drill 0.51)
  Top 0.254: U2.52 73.38,28.78 v74.09,28.07 | v90.81,30.48 LED6.C
  Bottom 0.254: v90.81,30.48 88.01,30.48 84.48,26.95 76.43,26.95 75.31,28.07 v74.09,28.07
LED7_N  (via drill 0.51)
  Top 0.254: U2.53 73.56,29.29 74.14,29.87 v74.19,29.87 | v90.75,33.02 LED7.C
  Bottom 0.254: v90.75,33.02 89.59,33.02 84.12,27.56 76.56,27.56 75.92,28.19 75.92,28.65 74.7,29.87 v74.19,29.87
LED8_N  (via drill 0.51)
  Top 0.254: U2.56 74.6,30.79 v76.86,28.52 | v90.75,35.56 LED8.C
  Bottom 0.254: v76.86,28.52 83.69,28.52 90.73,35.56 v90.75,35.56
MCLR  (via drill 0.51)
  Top 0.241: ICSP1.1 35.56,5.08
  Top 0.254: 35.56,5.08 49.42,18.94 49.78,19.3 49.94,19.46 49.94,30.15 47.42,32.66 v47.42,35.69 47.42,37.25 R9.1 | v50.88,35.69 53.52,35.69 54.91,34.29 U2.13
  Bottom 0.254: v47.42,35.69 v50.88,35.69
N$2
  Top 0.254: U5.5 16.48,14.99 16.51,14.99
  Top 1.27: 16.51,14.99 19.61,14.99 L2.1
N$4  (via drill 0.51)
  Top 0.254: v45.47,71.63 U6.12 | U7.2 v34.29,71.63
  Bottom 0.254: v34.29,71.63 v45.47,71.63
N$5
  Top 0.254: LED1.A R27.1
N$6  (via drill 0.51)
  Top 0.254: v45.47,66.04 U6.9 | 33.02,69.34 U7.3 33.02,68.33 34.04,67.31 v35.05,67.31
  Bottom 0.254: v45.47,66.04 44.2,67.31 v35.05,67.31
N$7
  Top 0.254: U7.6 29.21,73.03 30.37,74.18 39,74.18 40.89,72.29 U6.19
N$8
  Top 0.254: U7.5 30.48,72.16 31.57,73.25 35.84,73.25 38.41,70.69 38.41,69.57 39.6,68.38 39.6,67.82 40.89,66.52 U6.2 40.89,64.47
N$9
  Top 0.254: 30.48,64.52 U7.10 R24.1 R23.2
N$11
  Top 0.254: LED2.A R28.1
N$12
  Top 0.254: R26.1 35.56,58.93 34.04,60.45 33.02,60.45 R25.2 U7.12
N$13
  Top 0.254: LED3.A R29.1
N$14
  Top 0.254: LED4.A R30.1
N$15
  Top 0.254: LED5.A R31.1
N$16
  Top 0.254: LED6.A R32.1
N$17
  Top 0.254: LED7.A R33.1
N$18
  Top 0.254: LED8.A R34.1
OSCI
  Top 0.254: Y1.P$1 84.23,34.05 C55.1 | 80.3,34.29 arc-90 Y1.P$1 | U2.63 80.3,34.29 | 80.3,34.29 Y1.P$1
OSCO
  Top 0.254: C54.1 84.23,38.55 Y1.P$2 80.33,38.33 80.03,38.33 76.5,34.8 U2.64
PGC  (via drill 0.51)
  Top 0.254: U2.26 57.51,26.01 v54.36,22.86 | v51.13,19.79 51.13,15.34 45.72,9.93 ICSP1.5
  Bottom 0.254: v54.36,22.86 51.28,19.79 v51.13,19.79
PGD  (via drill 0.51)
  Top 0.254: U2.27 57.99,25.73 55.27,23.01 55.27,22.48 54.79,22 54.66,22 53.21,20.55 53.21,19.53 53.52,19.23 v53.52,16.84 | v48.39,15.54 43.18,10.34 ICSP1.4
  Bottom 0.254: v53.52,16.84 49.68,16.84 v48.39,15.54
RPI+3V1
  Top 0.254: 35.98,33.08 R36.2 | R36.2 35.88,34.39 | R36.2 35.88,34.19
  Top 0.813: RPI1.P2-1 35.98,33.08 | 35.88,34.39 C26.2 | 35.88,34.19 C27.1
RPI+3V3
  Top 0.254: 86.26,16.93 C24.2 | C25.1 83,16.83 83,16.93
  Top 0.813: 86.26,16.93 R35.2 83,16.93 | RPI1.P1-1 83,16.83
  Bottom 0.813: RPI1.P1-1 83,13.68 81.97,14.71 64.62,14.71 RPI1.P1-17
RPI-RDX0
  Top 0.254: RPI1.P1-10 72.9,10.16 R1.1
SPI_CE  (via drill 0.51)
  Top 0.241: 64.01,8.91 63.25,8.15 57.12,8.15
  Top 0.254: v74.47,21.03 74.47,23.06 71.07,26.47 71.07,26.67 69.6,28.14 69.19,28.14 68.2,29.13 68.2,30.05 67.16,31.09 67.16,34.65 69.8,37.29 U2.69 | 64.01,8.91 64.01,13.66 68.02,17.68 v71.09,17.68 | RPI1.P1-24 57.12,8.15
  Bottom 0.254: v74.47,21.03 71.12,17.68 v71.09,17.68
SPI_SCK  (via drill 0.51)
  Top 0.254: U2.70 69.42,37.8 66.19,34.57 66.19,30.76 v67.28,29.67 | RPI1.P1-23 55.05,13.22 54.41,13.87 54.41,17.25 54.13,17.53 v54.13,19.96
  Bottom 0.254: v54.13,19.96 55.91,19.96 57.56,19.96 57.58,19.96 v67.28,29.67
SPI_SDI  (via drill 0.51)
  Top 0.254: v60.12,14.86 60.12,12.78 RPI1.P1-19 | v48.92,37.69 48.92,32.26 50.52,30.66 50.52,22.63 52.07,21.08 v52.07,14.86 | U2.9 54.13,36.3 v52.7,37.72
  Bottom 0.254: v52.7,37.72 48.92,37.72 v48.92,37.69 | v52.07,14.86 v60.12,14.86
SPI_SDO  (via drill 0.51)
  Top 0.254: v64.77,29.44 64.77,35.53 68.02,38.79 U2.72 | v55.02,21.08 55.02,15.34 RPI1.P1-21
  Bottom 0.254: v55.02,21.08 55.8,21.87 55.8,22.99 62.26,29.44 v64.77,29.44
SUPPLY
  Top 0.241: U3.1 14.51,47.38 12.68,45.54 10.57,45.54 7.09,42.06 7.09,37.52
  Top 0.254: C15.2 17.8,54.92 C14.2 12.74,54.95 | 6.88,37.49 R10.2 7.09,37.52
  Top 1.27: 6.88,37.49 5.49,38.89 5.49,40.46
  pour Top: 1.3,64.16 11.28,64.16 13.84,61.59 13.84,53.26 9.37,48.79 9.37,46.3 9.35,45.31 6.25,42.21 6.25,40.16 1.27,40.16 1.27,64.14
SW
  pour Top (no thermals): 14.07,40.18 14.07,37.16 14.5,36.8 18.47,36.8 18.8,36.4 19.58,36.4 19.58,36.55 19.84,36.8 19.99,36.8 20.02,36.83 20.04,37.44 20.29,37.69 21.16,37.69 21.44,37.41 21.44,36.86 21.49,36.8 21.67,36.8 21.95,36.53 21.95,36.37 21.97,36.35 22.5,36.35 22.53,39.29 21.56,40.18
TRCLK  (via drill 0.51)
  Top 0.254: U2.91 62,40.84 63.14,39.7 v63.14,38.05 | R8.2 50.39,41.91 v51.46,42.98
  Bottom 0.254: v63.14,38.05 62.05,39.14 58.17,39.14 55.85,41.45 52.68,41.45 51.46,42.67 v51.46,42.98
TRCLK_R
  Top 0.254: J1.1 R8.1
TRD0
  Top 0.254: R4.2 55.78,44.45 57,45.67 58.45,45.67 59,45.11 U2.97
TRD0_R
  Top 0.254: J1.3 R4.1
TRD1
  Top 0.254: 50.51,47.12 R5.2 51.17,46.2 58.65,46.2 59.51,45.34 U2.96
TRD1_R
  Top 0.254: J1.5 R5.1
TRD2
  Top 0.254: R6.2 52.95,46.97 58.75,46.97 59.99,45.72 U2.95
TRD2_R
  Top 0.254: J1.7 R6.1
TRD3
  Top 0.254: R7.2 50.55,52.07 50.55,51.99 51.46,51.08 51.46,49.23 52.58,48.11 58.22,48.11 58.73,48.11 59.44,48.11 61.92,45.62 61.92,43.28 61.49,42.85 U2.92
TRD3_R
  Top 0.254: J1.9 R7.1
U3_ADDR_SEL
  Top 0.241: U3.6 18.08,44.51 R11.1
U4_ADDR_SEL
  Top 0.254: R18.1 11.18,24.77 11.58,25.17 U4.6
VDDCORE
  Top 0.254: U2.85 65,45.15 C11.1
VIN  (via drill 0.51)
  Top 0.241: U3.2 14.76,46.88 12.81,44.93 10.72,44.93 7.62,41.83 7.62,39.37 R10.1
  Top 0.254: U1.11 23.9,35.86 v24.08,36.04 | 10.41,37.21 10.26,37.36 | 12.6,37.57 12.24,37.21 12.24,37.16 12.37,37.03
  Top 0.813: 10.26,37.36 C4.2 | 12.6,37.57 C5.2
  Bottom 0.254: 17.96,34.7 17.96,34.85
  Bottom 1.016: 17.96,34.7 23.82,34.7
  Bottom 1.27: v24.08,36.04 23.85,35.81 v17.93,35.81 | 23.82,34.7 v24.05,34.92 | v17.93,34.7 17.96,34.7
  pour Top (no thermals): 19.46,35.84 19.46,35.41 18.8,35.38 18.21,34.75 9.3,34.75 8.31,35.74 8.31,38.61 8.79,38.61 8.31,38.66 13.51,38.66 13.51,36.98 14.05,36.2 18.03,36.2 18.54,35.84
VREF
  Top 0.254: U2.29 59,25.55 58.62,25.17 58.32,25.17 55.93,22.78 55.93,21.79 57.07,20.65 59.6,20.65 | U8.2 59.6,19.06 59.6,20.65 | 59.6,20.65 60.63,21.68 C23.2

### Text on the board
Top: TOP
Bottom: BOTTOM
tPlace: TRISThis | V2.6